# EAGLE design RF-PWR-001 (EAGLE 9.6.2)
DOCNUM: RF-PWR-001; DWBY: Lewis Russell; DWDATE: 3/2/2021; DWINIT: LR; REV: 001; TITLE: RF Power Supply Board

## Sheet 1 of 4
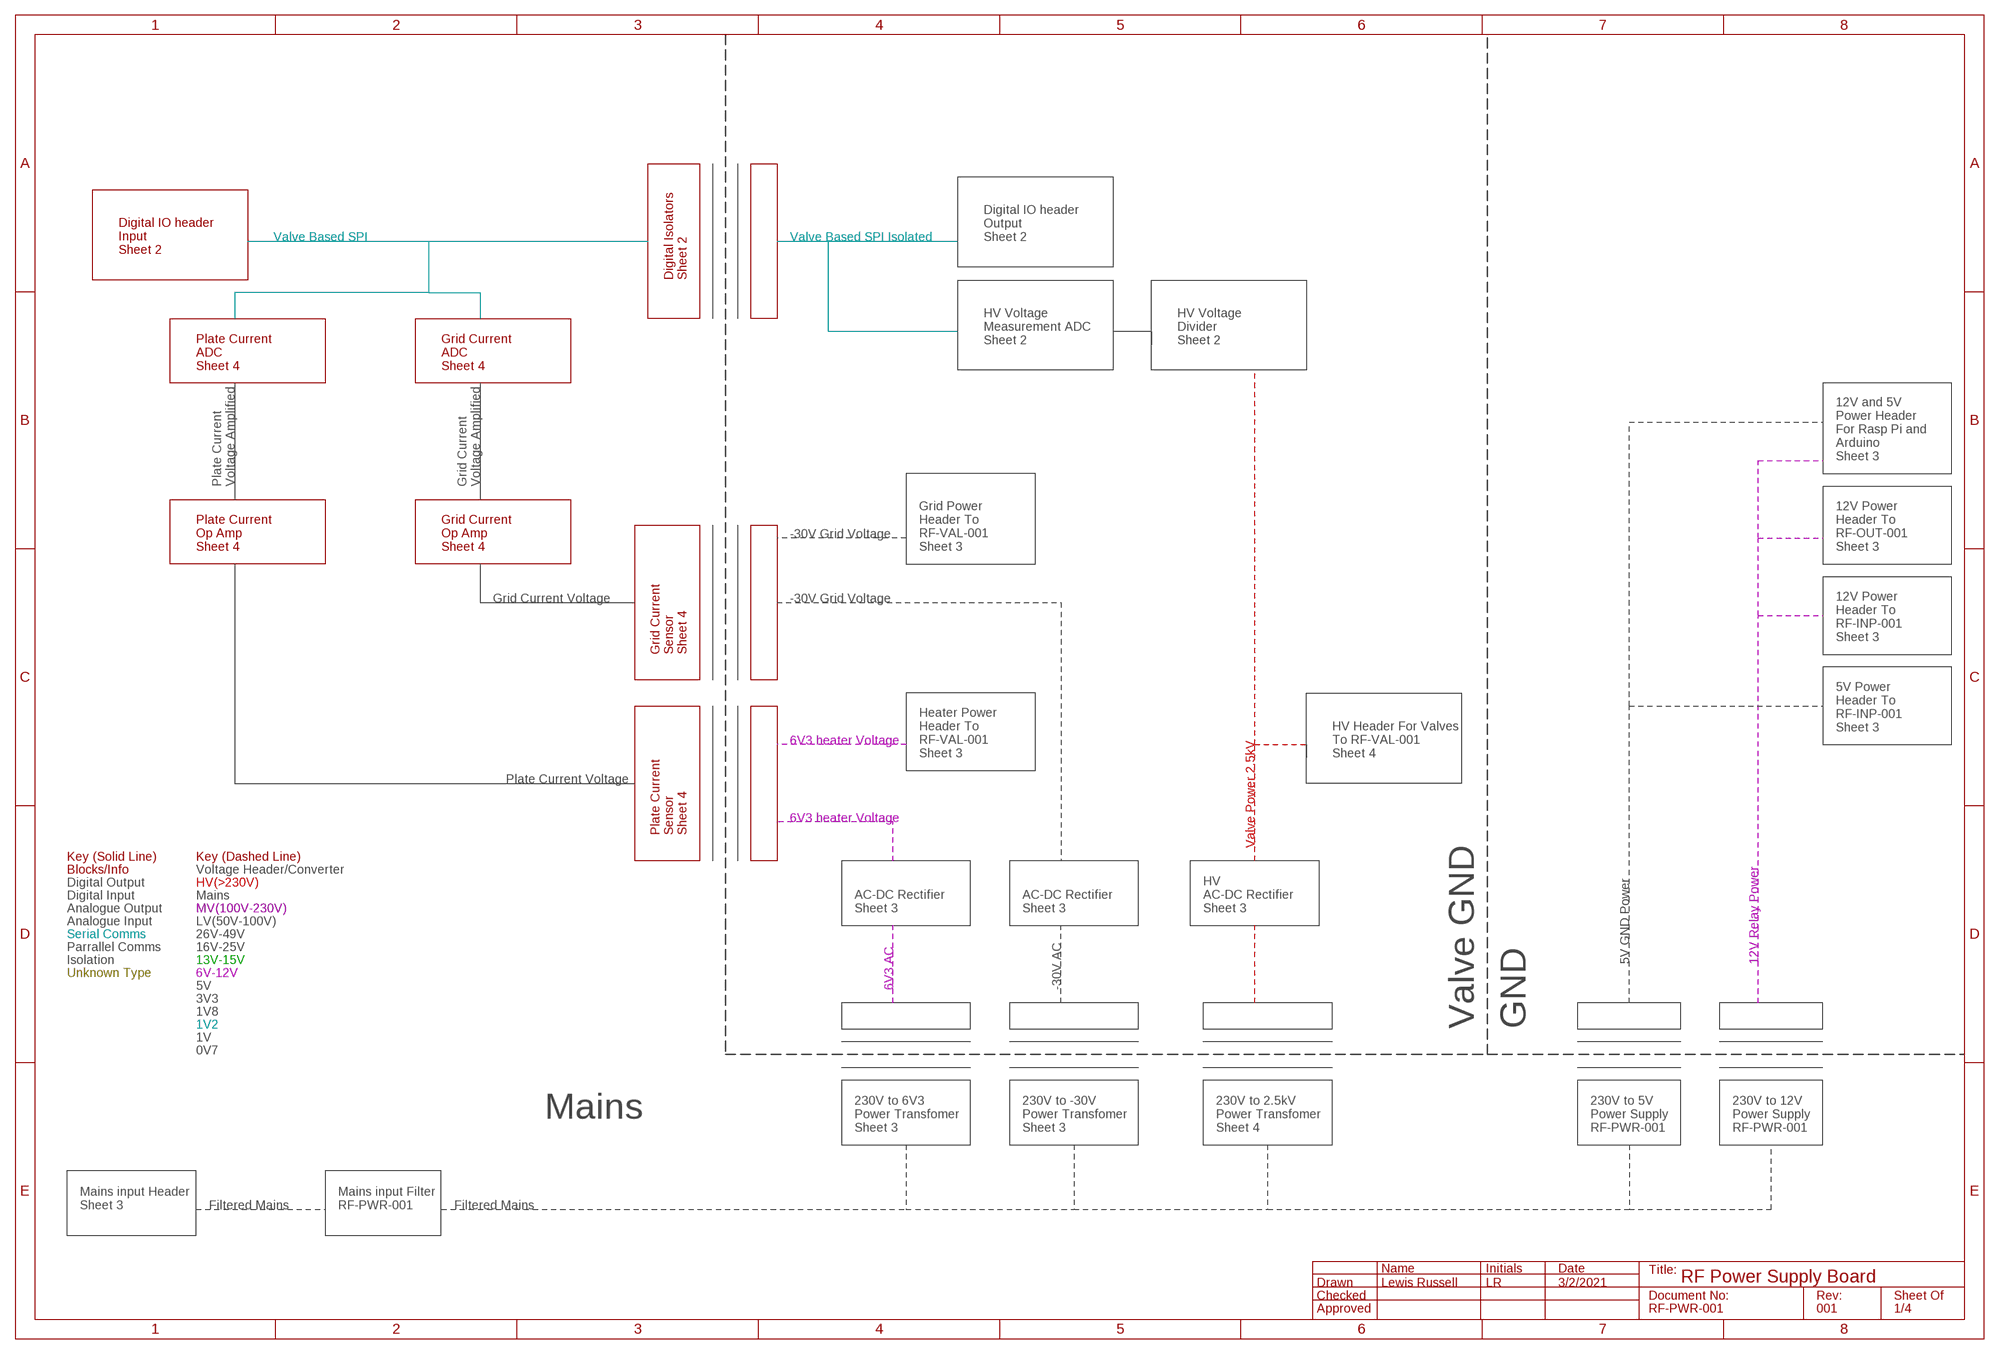
[diagram p0: schematic, sheet 1]

### Notes on the sheet
- Valve Based SPI | Valve Based SPI Isolated
- Digital IO header
  Output
  Sheet 2
- Digital IO header
  Input
  Sheet 2
- Digital Isolators
  Sheet 2
- HV Voltage
  Measurement ADC
  Sheet 2
- HV Voltage
  Divider
  Sheet 2
- Plate Current
  ADC
  Sheet 4
- Grid Current
  ADC
  Sheet 4
- 12V and 5V
  Power Header 
  For Rasp Pi and
  Arduino
  Sheet 3
- Plate Current
  Voltage Amplified
- Grid Current
  Voltage Amplified
- -30V Grid Voltage
- Plate Current
  Op Amp
  Sheet 4
- Grid Current
  Op Amp
  Sheet 4
- Grid Power
  Header To
  RF-VAL-001
  Sheet 3
- 12V Power
  Header To
  RF-OUT-001
  Sheet 3
- Grid Current Voltage | -30V Grid Voltage
- 12V Power
  Header To
  RF-INP-001
  Sheet 3
- Grid Current
  Sensor
  Sheet 4
- 5V Power
  Header To
  RF-INP-001
  Sheet 3
- 6V3 heater Voltage
- Heater Power
  Header To
  RF-VAL-001
  Sheet 3
- HV Header For Valves
  To RF-VAL-001
  Sheet 4
- Plate Current Voltage
- 6V3 heater Voltage
- Plate Current
  Sensor
  Sheet 4
- Valve Power 2.5kV
- Key (Solid Line) | Key (Dashed Line)
- Blocks/Info | Voltage Header/Converter
- Digital Output | HV(>230V)
- Digital Input | Mains
- Analogue Output | MV(100V-230V)
- AC-DC Rectifier
  Sheet 3
- AC-DC Rectifier
  Sheet 3
- HV
  AC-DC Rectifier
  Sheet 3
- Analogue Input | LV(50V-100V)
- Serial Comms | 26V-49V
- Parrallel Comms | 16V-25V
- Isolation | 13V-15V | 5V GND Power | 12V Relay Power
- Unknown Type | 6V-12V
- 5V | 6V3 AC | -30V AC
- 3V3
- 1V8
- 1V2 | Valve GND | GND
- 1V
- 0V7
- Mains
- 230V to 6V3
  Power Transfomer
  Sheet 3
- 230V to -30V
  Power Transfomer
  Sheet 3
- 230V to 2.5kV
  Power Transfomer
  Sheet 4
- 230V to 5V
  Power Supply
  RF-PWR-001
- 230V to 12V
  Power Supply
  RF-PWR-001
- Mains input Header
  Sheet 3
- Filtered Mains
- Mains input Filter
  RF-PWR-001
- Filtered Mains

## Sheet 2 of 4: Isolators
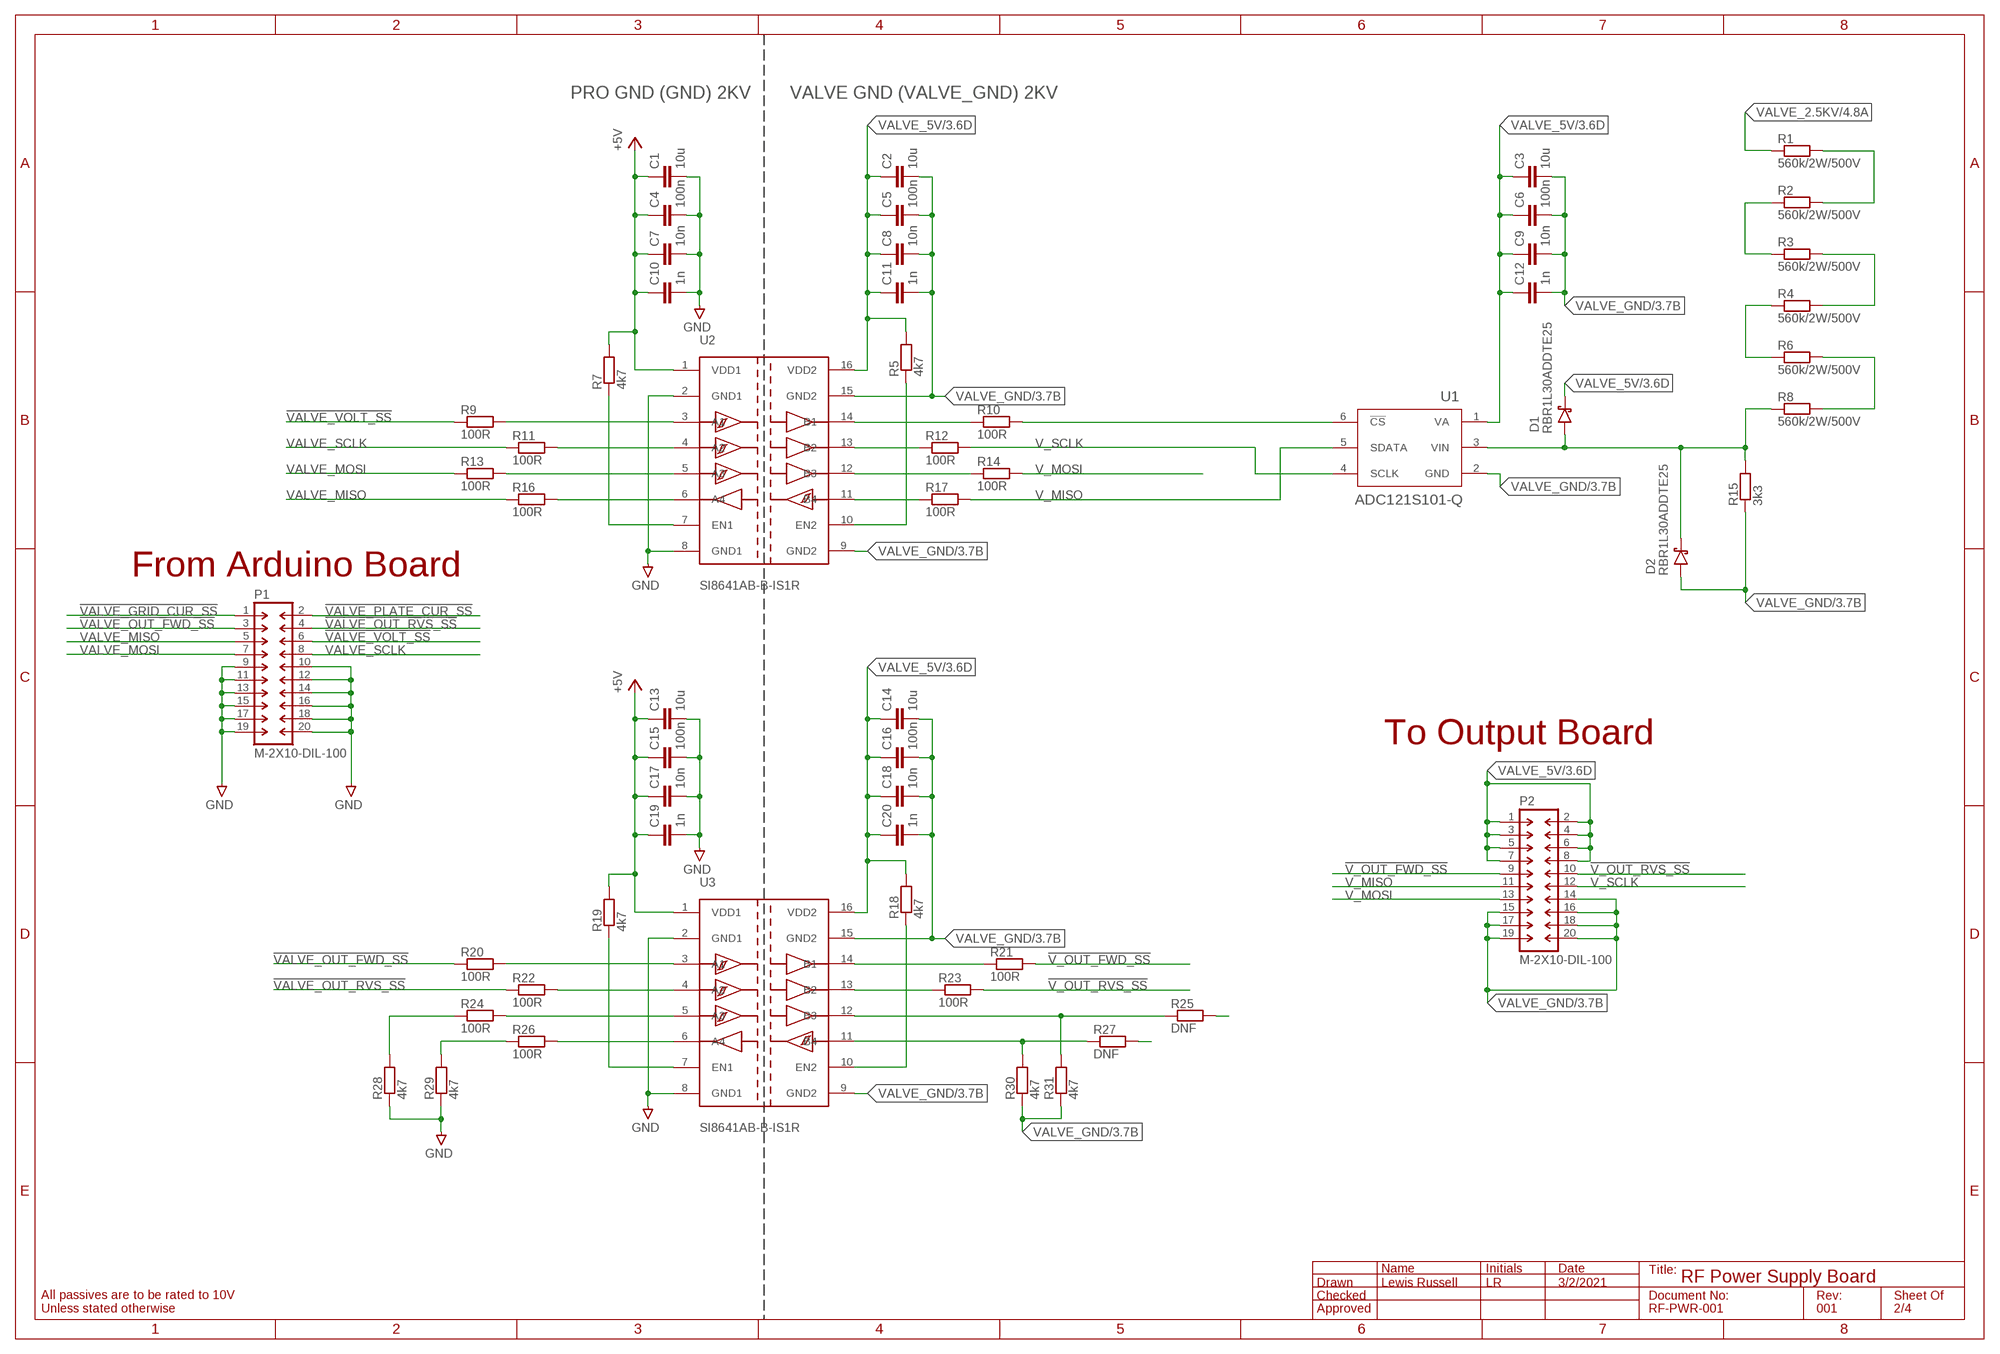
[diagram p1: schematic, sheet 2]

### Parts
C1  10u  C-EUC0805  [C0805]
C2  10u  C-EUC0805  [C0805]
C3  10u  C-EUC0805  [C0805]
C4  100n  C-EUC0603  [C0603]
C5  100n  C-EUC0603  [C0603]
C6  100n  C-EUC0603  [C0603]
C7  10n  C-EUC0603  [C0603]
C8  10n  C-EUC0603  [C0603]
C9  10n  C-EUC0603  [C0603]
C10  1n  C-EUC0603  [C0603]
C11  1n  C-EUC0603  [C0603]
C12  1n  C-EUC0603  [C0603]
C13  10u  C-EUC0805  [C0805]
C14  10u  C-EUC0805  [C0805]
C15  100n  C-EUC0603  [C0603]
C16  100n  C-EUC0603  [C0603]
C17  10n  C-EUC0603  [C0603]
C18  10n  C-EUC0603  [C0603]
C19  1n  C-EUC0603  [C0603]
C20  1n  C-EUC0603  [C0603]
D1  RBR1L30ADDTE25  SCHOTTKY_DIODESMA  [SMA/DO-214AC]
D2  RBR1L30ADDTE25  SCHOTTKY_DIODESMA  [SMA/DO-214AC]
P1  M-2X10-DIL-100  [DIL-100-2X10]
P2  M-2X10-DIL-100  [DIL-100-2X10]
R1  560k/2W/500V  R-EU_SMF2  [SMV1/SMF2]
R2  560k/2W/500V  R-EU_SMF2  [SMV1/SMF2]
R3  560k/2W/500V  R-EU_SMF2  [SMV1/SMF2]
R4  560k/2W/500V  R-EU_SMF2  [SMV1/SMF2]
R5  4k7  R-EUR0603  [R0603]
R6  560k/2W/500V  R-EU_SMF2  [SMV1/SMF2]
R7  4k7  R-EUR0603  [R0603]
R8  560k/2W/500V  R-EU_SMF2  [SMV1/SMF2]
R9  100R  R-EUR0603  [R0603]
R10  100R  R-EUR0603  [R0603]
R11  100R  R-EUR0603  [R0603]
R12  100R  R-EUR0603  [R0603]
R13  100R  R-EUR0603  [R0603]
R14  100R  R-EUR0603  [R0603]
R15  3k3  R-EUR0603  [R0603]
R16  100R  R-EUR0603  [R0603]
R17  100R  R-EUR0603  [R0603]
R18  4k7  R-EUR0603  [R0603]
R19  4k7  R-EUR0603  [R0603]
R20  100R  R-EUR0603  [R0603]
R21  100R  R-EUR0603  [R0603]
R22  100R  R-EUR0603  [R0603]
R23  100R  R-EUR0603  [R0603]
R24  100R  R-EUR0603  [R0603]
R25  DNF  R-EUR0603  [R0603]
R26  100R  R-EUR0603  [R0603]
R27  DNF  R-EUR0603  [R0603]
R28  4k7  R-EUR0603  [R0603]
R29  4k7  R-EUR0603  [R0603]
R30  4k7  R-EUR0603  [R0603]
R31  4k7  R-EUR0603  [R0603]
U1  ADC121S101-Q  [SOT23-6]
U2  SI8641AB-B-IS1R  SI8641SO16  [SO16]
U3  SI8641AB-B-IS1R  SI8641SO16  [SO16]

### Nets
!V_OUT_FWD_SS [Valve LV+Signal]: P2.9 R21.2
!V_OUT_RVS_SS [Valve LV+Signal]: P2.10 R23.2
!VALVE_GRID_CUR_SS [GND Volt+Signal]: P1.1 ; also sheet 4
!VALVE_OUT_FWD_SS [GND Volt+Signal]: P1.3 R20.1
!VALVE_OUT_RVS_SS [GND Volt+Signal]: P1.4 R22.1
!VALVE_PLATE_CUR_SS [GND Volt+Signal]: P1.2 ; also sheet 4
!VALVE_VOLT_SS [GND Volt+Signal]: P1.6 R9.1
+5V [GND Volt+Signal]: C1.1 C4.1 C7.1 C10.1 C13.1 C15.1 C17.1 C19.1 R7.2 R19.2 U2.1(VDD1) U3.1(VDD1) ; also sheet 3,4
GND [GND Volt+Signal]: C1.2 C4.2 C7.2 C10.2 C13.2 C15.2 C17.2 C19.2 P1.9 P1.10 P1.11 P1.12 P1.13 P1.14 P1.15 P1.16 P1.17 P1.18 P1.19 P1.20 R28.1 R29.1 U2.2(GND1) U2.8(GND1) U3.2(GND1) U3.8(GND1) ; also sheet 3,4
N$5 [Valve LV+Signal]: R27.2
N$7 [Valve LV+Signal]: R25.2
N$40 [GND Volt+Signal]: R24.1 R28.2
N$41 [GND Volt+Signal]: R13.2 U2.5(A3)
N$42 [GND Volt+Signal]: R16.2 U2.6(A4)
N$44 [GND Volt+Signal]: R11.2 U2.4(A2)
N$46 [GND Volt+Signal]: R9.2 U2.3(A1)
N$47 [GND Volt+Signal]: R7.1 U2.7(EN1)
N$50 [Valve LV+Signal]: R5.1 U2.10(EN2)
N$51 [Valve LV+Signal]: R14.1 U2.12(B3)
N$54 [Valve LV+Signal]: R17.1 U2.11(B4)
N$55 [Valve LV+Signal]: R27.1 R30.2 U3.11(B4)
N$57 [Valve LV+Signal]: R12.1 U2.13(B2)
N$58 [Valve LV+Signal]: R10.1 U2.14(B1)
N$60 [Valve LV+Signal]: R10.2 U1.6(!CS)
N$61 [Valve LV+Signal]: R23.1 U3.13(B2)
N$62 [Valve LV+Signal]: R21.1 U3.14(B1)
N$63 [Valve LV+Signal]: D1.A(ANODE) D2.C(CATHODE) R8.1 R15.2 U1.3(VIN)
N$68 [Valve Ladder 500V Step]: R4.1 R6.1
N$70 [Valve 500V]: R6.2 R8.2
N$75 [Valve Ladder 500V Step]: R3.2 R4.2
N$77 [Valve Ladder 500V Step]: R1.2 R2.2
N$78 [Valve Ladder 500V Step]: R2.1 R3.1
N$92 [GND Volt+Signal]: R24.2 U3.5(A3)
N$93 [GND Volt+Signal]: R26.2 U3.6(A4)
N$94 [GND Volt+Signal]: R22.2 U3.4(A2)
N$95 [GND Volt+Signal]: R20.2 U3.3(A1)
N$96 [GND Volt+Signal]: R19.1 U3.7(EN1)
N$97 [Valve LV+Signal]: R18.1 U3.10(EN2)
N$98 [Valve LV+Signal]: R25.1 R31.2 U3.12(B3)
N$106 [GND Volt+Signal]: R26.1 R29.2
V_MISO [Valve LV+Signal]: P2.11 R17.2 U1.5(SDATA)
V_MOSI [Valve LV+Signal]: P2.13 R14.2
V_SCLK [Valve LV+Signal]: P2.12 R12.2 U1.4(SCLK)
VALVE_2.5KV [Valve 2500V]: R1.1 ; also sheet 4
VALVE_5V [Valve LV+Signal]: C2.1 C3.1 C5.1 C6.1 C8.1 C9.1 C11.1 C12.1 C14.1 C16.1 C18.1 C20.1 D1.C(CATHODE) P2.1 P2.2 P2.3 P2.4 P2.5 P2.6 P2.7 P2.8 R5.2 R18.2 U1.1(VA) U2.16(VDD2) U3.16(VDD2) ; also sheet 3
VALVE_GND [Valve 48V]: C2.2 C3.2 C5.2 C6.2 C8.2 C9.2 C11.2 C12.2 C14.2 C16.2 C18.2 C20.2 D2.A(ANODE) P2.14 P2.15 P2.16 P2.17 P2.18 P2.19 P2.20 R15.1 R30.1 R31.1 U1.2(GND) U2.9(GND2) U2.15(GND2) U3.9(GND2) U3.15(GND2) ; also sheet 3,4
VALVE_MISO [GND Volt+Signal]: P1.5 R16.1 ; also sheet 4
VALVE_MOSI [GND Volt+Signal]: P1.7 R13.1
VALVE_SCLK [GND Volt+Signal]: P1.8 R11.1 ; also sheet 4

### Notes on the sheet
- PRO GND (GND) 2KV | VALVE GND (VALVE_GND) 2KV
- From Arduino Board
- To Output Board
- All passives are to be rated to 10V
  Unless stated otherwise

## Sheet 3 of 4: Mains Input and Voltage Regulation
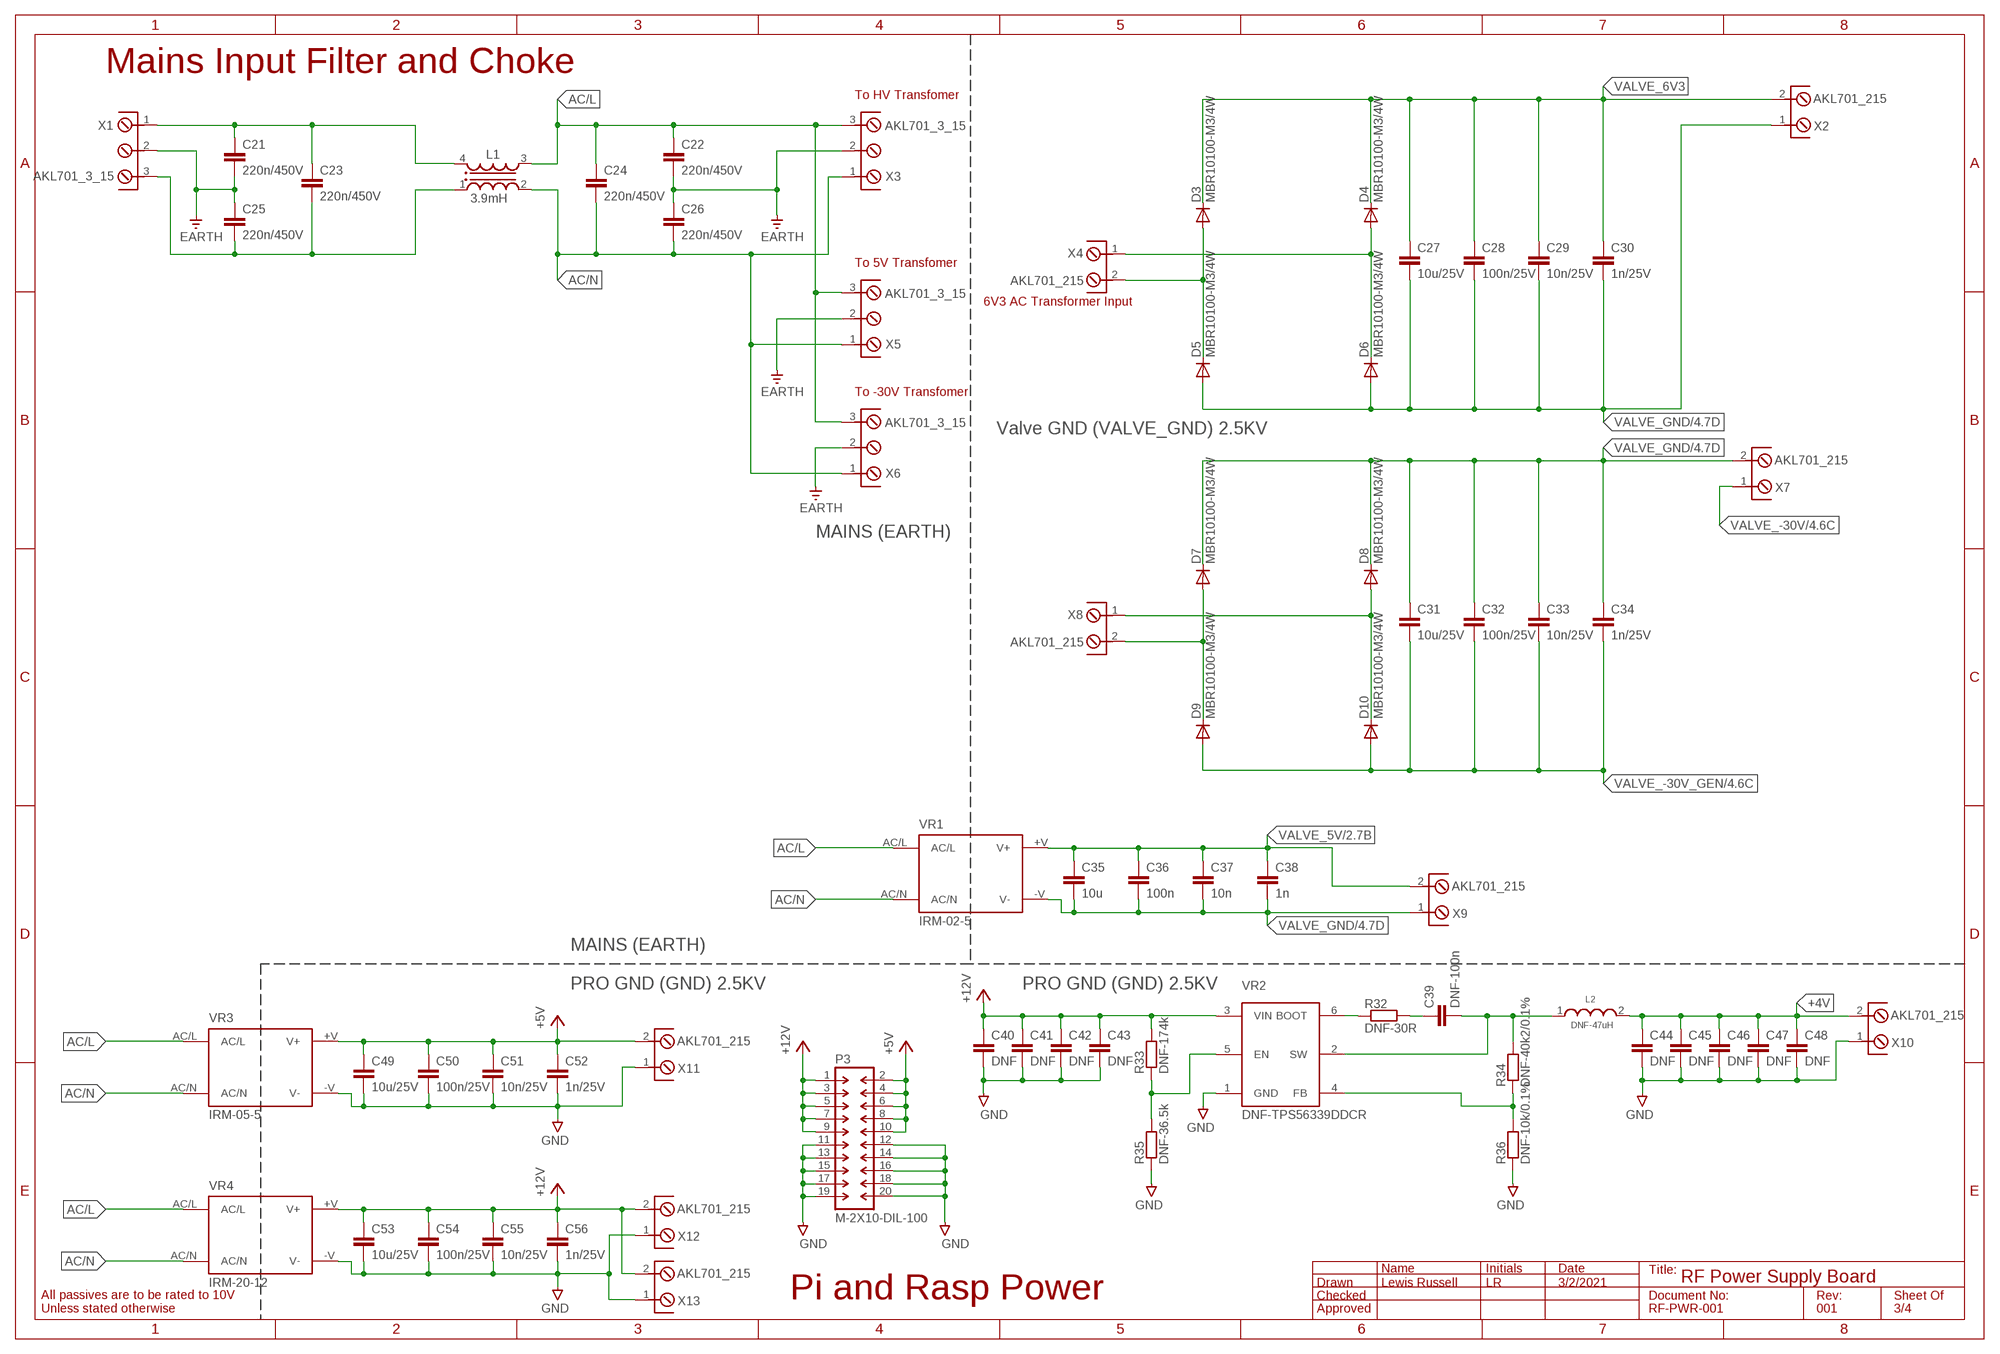
[diagram p2: schematic, sheet 3]

### Parts
C21  220n/450V  C-EUC1210  [C1210]
C22  220n/450V  C-EUC1210  [C1210]
C23  220n/450V  C-EUC1210  [C1210]
C24  220n/450V  C-EUC1210  [C1210]
C25  220n/450V  C-EUC1210  [C1210]
C26  220n/450V  C-EUC1210  [C1210]
C27  10u/25V  C-EUC0805  [C0805]
C28  100n/25V  C-EUC0603  [C0603]
C29  10n/25V  C-EUC0603  [C0603]
C30  1n/25V  C-EUC0603  [C0603]
C31  10u/25V  C-EUC0805  [C0805]
C32  100n/25V  C-EUC0603  [C0603]
C33  10n/25V  C-EUC0603  [C0603]
C34  1n/25V  C-EUC0603  [C0603]
C35  10u  C-EUC0805  [C0805]
C36  100n  C-EUC0603  [C0603]
C37  10n  C-EUC0603  [C0603]
C38  1n  C-EUC0603  [C0603]
C39  DNF-100n  C-EUC0603  [C0603]
C40  DNF  C-EUC0805  [C0805]
C41  DNF  C-EUC0603  [C0603]
C42  DNF  C-EUC0603  [C0603]
C43  DNF  C-EUC0603  [C0603]
C44  DNF  C-EUC1206  [C1206]
C45  DNF  C-EUC0805  [C0805]
C46  DNF  C-EUC0603  [C0603]
C47  DNF  C-EUC0603  [C0603]
C48  DNF  C-EUC0603  [C0603]
C49  10u/25V  C-EUC0805  [C0805]
C50  100n/25V  C-EUC0603  [C0603]
C51  10n/25V  C-EUC0603  [C0603]
C52  1n/25V  C-EUC0603  [C0603]
C53  10u/25V  C-EUC0805  [C0805]
C54  100n/25V  C-EUC0603  [C0603]
C55  10n/25V  C-EUC0603  [C0603]
C56  1n/25V  C-EUC0603  [C0603]
D3  MBR10100-M3/4W  DIODE-TO220V  [TO220ACS]
D4  MBR10100-M3/4W  DIODE-TO220V  [TO220ACS]
D5  MBR10100-M3/4W  DIODE-TO220V  [TO220ACS]
D6  MBR10100-M3/4W  DIODE-TO220V  [TO220ACS]
D7  MBR10100-M3/4W  DIODE-TO220V  [TO220ACS]
D8  MBR10100-M3/4W  DIODE-TO220V  [TO220ACS]
D9  MBR10100-M3/4W  DIODE-TO220V  [TO220ACS]
D10  MBR10100-M3/4W  DIODE-TO220V  [TO220ACS]
L1  3.9mH  WE-FCL_ET35_744866392  [WE-FCL_ET35]
L2  DNF-47uH  WE-HCF_2920_ROUND_74437529203470  [WE-HCF_2920_ROUND]
P3  M-2X10-DIL-100  [DIL-100-2X10]
R32  DNF-30R  R-EUR0603  [R0603]
R33  DNF-174k  R-EUR0603  [R0603]
R34  DNF-40k2/0.1%  R-EUR0603  [R0603]
R35  DNF-36.5k  R-EUR0603  [R0603]
R36  DNF-10k/0.1%  R-EUR0603  [R0603]
VR1  IRM-02-5  [IRM_1-2_TH]
VR2  DNF-TPS56339DDCR  TPS56339DDCR  [SOT23-6]
VR3  IRM-05-5  [IRM_5-10_TH]
VR4  IRM-20-12  [IRM_15-20_TH]
X1  AKL701_3_15  [AKL701_3_15]
X2  AKL701_215  [AKL701_2_15]
X3  AKL701_3_15  [AKL701_3_15]
X4  AKL701_215  [AKL701_2_15]
X5  AKL701_3_15  [AKL701_3_15]
X6  AKL701_3_15  [AKL701_3_15]
X7  AKL701_215  [AKL701_2_15]
X8  AKL701_215  [AKL701_2_15]
X9  AKL701_215  [AKL701_2_15]
X10  AKL701_215  [AKL701_2_15]
X11  AKL701_215  [AKL701_2_15]
X12  AKL701_215  [AKL701_2_15]
X13  AKL701_215  [AKL701_2_15]

### Nets
+4V [GND Volt+Signal]: C44.1 C45.1 C46.1 C47.1 C48.1 L2.2 X10.2
+5V [GND Volt+Signal]: C49.1 C50.1 C51.1 C52.1 P3.2 P3.4 P3.6 P3.8 P3.10 VR3.+V(V+) X11.2 ; also sheet 2,4
+12V [GND Volt+Signal]: C40.1 C41.1 C42.1 C43.1 C53.1 C54.1 C55.1 C56.1 P3.1 P3.3 P3.5 P3.7 P3.9 R33.2 VR2.3(VIN) VR4.+V(V+) X12.2 X13.2
AC/L [Mains]: C22.1 C24.1 L1.3 VR1.AC/L VR3.AC/L VR4.AC/L X3.3 X5.3 X6.3
AC/N [Mains]: C24.2 C26.2 L1.2 VR1.AC/N VR3.AC/N VR4.AC/N X3.1 X5.1 X6.1
EARTH [Mains]: C21.2 C22.2 C25.1 C26.1 X1.2 X3.2 X5.2 X6.2
GND [GND Volt+Signal]: C40.2 C41.2 C42.2 C43.2 C44.2 C45.2 C46.2 C47.2 C48.2 C49.2 C50.2 C51.2 C52.2 C53.2 C54.2 C55.2 C56.2 P3.11 P3.12 P3.13 P3.14 P3.15 P3.16 P3.17 P3.18 P3.19 P3.20 R35.1 R36.1 VR2.1(GND) VR3.-V(V-) VR4.-V(V-) X10.1 X11.1 X12.1 X13.1 ; also sheet 2,4
N$1 [Valve LV+Signal]: D3.A D5.C X4.2
N$2 [Valve LV+Signal]: D4.A D6.C X4.1
N$6 [GND Volt+Signal]: R33.1 R35.2 VR2.5(EN)
N$9 [Valve LV+Signal]: D7.A D9.C X8.2
N$10 [Valve LV+Signal]: D8.A D10.C X8.1
N$31 [Mains]: C21.1 C23.1 L1.4 X1.1
N$35 [Mains]: C23.2 C25.2 L1.1 X1.3
N$104 [GND Volt+Signal]: C39.1 R32.2
N$105 [GND Volt+Signal]: C39.2 L2.1 R34.2 VR2.2(SW)
N$148 [GND Volt+Signal]: R34.1 R36.2 VR2.4(FB)
N$300 [GND Volt+Signal]: R32.1 VR2.6(BOOT)
VALVE_5V [Valve LV+Signal]: C35.1 C36.1 C37.1 C38.1 VR1.+V(V+) X9.2 ; also sheet 2
VALVE_6V3 [Valve LV+Signal]: C27.1 C28.1 C29.1 C30.1 D3.C D4.C X2.2
VALVE_-30V [Valve 48V]: X7.1 ; also sheet 4
VALVE_-30V_GEN [Valve 48V]: C31.2 C32.2 C33.2 C34.2 D9.A D10.A ; also sheet 4
VALVE_GND [Valve 48V]: C27.2 C28.2 C29.2 C30.2 C31.1 C32.1 C33.1 C34.1 C35.2 C36.2 C37.2 C38.2 D5.A D6.A D7.C D8.C VR1.-V(V-) X2.1 X7.2 X9.1 ; also sheet 2,4

### Notes on the sheet
- Mains Input Filter and Choke
- To HV Transfomer
- To 5V Transfomer
- 6V3 AC Transformer Input
- To -30V Transfomer
- Valve GND (VALVE_GND) 2.5KV
- MAINS (EARTH)
- MAINS (EARTH)
- PRO GND (GND) 2.5KV | PRO GND (GND) 2.5KV
- Pi and Rasp Power
- All passives are to be rated to 10V
  Unless stated otherwise

## Sheet 4 of 4: HV Rectification and Current Sensing
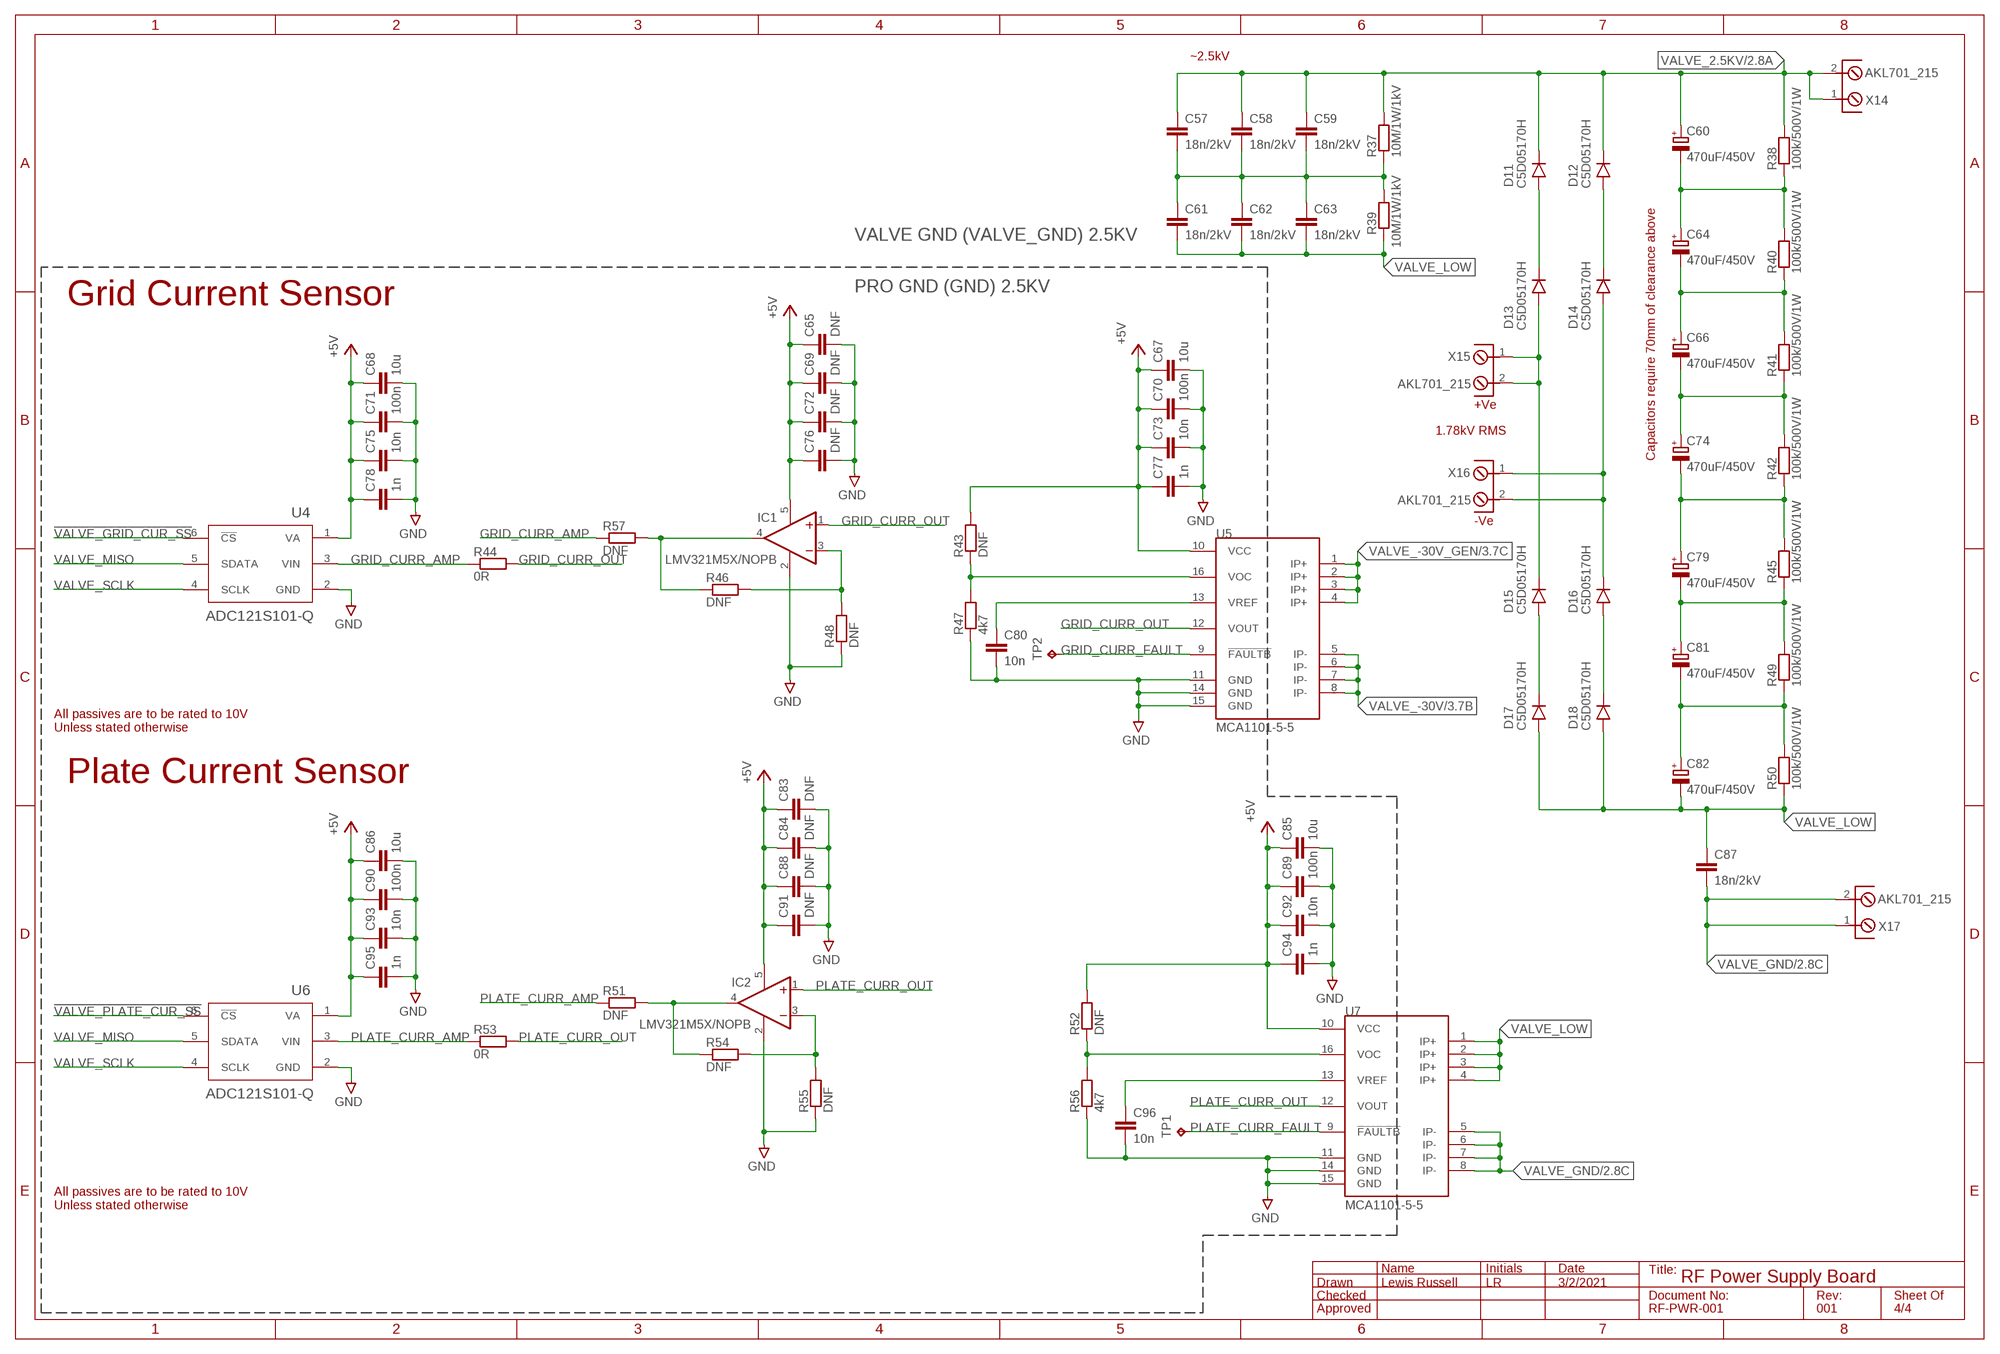
[diagram p3: schematic, sheet 4]

### Parts
C57  18n/2kV  C-EU050-075X075  [C050-075X075]
C58  18n/2kV  C-EU050-075X075  [C050-075X075]
C59  18n/2kV  C-EU050-075X075  [C050-075X075]
C60  470uF/450V  ALC10D-35MM  [STYLE_D(35MM)]
C61  18n/2kV  C-EU050-075X075  [C050-075X075]
C62  18n/2kV  C-EU050-075X075  [C050-075X075]
C63  18n/2kV  C-EU050-075X075  [C050-075X075]
C64  470uF/450V  ALC10D-35MM  [STYLE_D(35MM)]
C65  DNF  C-EUC0805  [C0805]
C66  470uF/450V  ALC10D-35MM  [STYLE_D(35MM)]
C67  10u  C-EUC0805  [C0805]
C68  10u  C-EUC0805  [C0805]
C69  DNF  C-EUC0603  [C0603]
C70  100n  C-EUC0603  [C0603]
C71  100n  C-EUC0603  [C0603]
C72  DNF  C-EUC0603  [C0603]
C73  10n  C-EUC0603  [C0603]
C74  470uF/450V  ALC10D-35MM  [STYLE_D(35MM)]
C75  10n  C-EUC0603  [C0603]
C76  DNF  C-EUC0603  [C0603]
C77  1n  C-EUC0603  [C0603]
C78  1n  C-EUC0603  [C0603]
C79  470uF/450V  ALC10D-35MM  [STYLE_D(35MM)]
C80  10n  C-EUC0603  [C0603]
C81  470uF/450V  ALC10D-35MM  [STYLE_D(35MM)]
C82  470uF/450V  ALC10D-35MM  [STYLE_D(35MM)]
C83  DNF  C-EUC0805  [C0805]
C84  DNF  C-EUC0603  [C0603]
C85  10u  C-EUC0805  [C0805]
C86  10u  C-EUC0805  [C0805]
C87  18n/2kV  C-EU050-075X075  [C050-075X075]
C88  DNF  C-EUC0603  [C0603]
C89  100n  C-EUC0603  [C0603]
C90  100n  C-EUC0603  [C0603]
C91  DNF  C-EUC0603  [C0603]
C92  10n  C-EUC0603  [C0603]
C93  10n  C-EUC0603  [C0603]
C94  1n  C-EUC0603  [C0603]
C95  1n  C-EUC0603  [C0603]
C96  10n  C-EUC0603  [C0603]
D11  C5D05170H  DIODEC1A3-2  [TO-247-2]
D12  C5D05170H  DIODEC1A3-2  [TO-247-2]
D13  C5D05170H  DIODEC1A3-2  [TO-247-2]
D14  C5D05170H  DIODEC1A3-2  [TO-247-2]
D15  C5D05170H  DIODEC1A3-2  [TO-247-2]
D16  C5D05170H  DIODEC1A3-2  [TO-247-2]
D17  C5D05170H  DIODEC1A3-2  [TO-247-2]
D18  C5D05170H  DIODEC1A3-2  [TO-247-2]
IC1  LMV321M5X/NOPB  LMV321M5  [SOT23-5]
IC2  LMV321M5X/NOPB  LMV321M5  [SOT23-5]
R37  10M/1W/1kV  R-EUR2512  [R2512]
R38  100k/500V/1W  R-EUR2512  [R2512]
R39  10M/1W/1kV  R-EUR2512  [R2512]
R40  100k/500V/1W  R-EUR2512  [R2512]
R41  100k/500V/1W  R-EUR2512  [R2512]
R42  100k/500V/1W  R-EUR2512  [R2512]
R43  DNF  R-EUR0603  [R0603]
R44  0R  R-EUR0603  [R0603]
R45  100k/500V/1W  R-EUR2512  [R2512]
R46  DNF  R-EUR0603  [R0603]
R47  4k7  R-EUR0603  [R0603]
R48  DNF  R-EUR0603  [R0603]
R49  100k/500V/1W  R-EUR2512  [R2512]
R50  100k/500V/1W  R-EUR2512  [R2512]
R51  DNF  R-EUR0603  [R0603]
R52  DNF  R-EUR0603  [R0603]
R53  0R  R-EUR0603  [R0603]
R54  DNF  R-EUR0603  [R0603]
R55  DNF  R-EUR0603  [R0603]
R56  4k7  R-EUR0603  [R0603]
R57  DNF  R-EUR0603  [R0603]
TP1  TPTP16R  [TP16R]
TP2  TPTP16R  [TP16R]
U4  ADC121S101-Q  [SOT23-6]
U5  MCA1101-5-5  [SOIC_16]
U6  ADC121S101-Q  [SOT23-6]
U7  MCA1101-5-5  [SOIC_16]
X14  AKL701_215  [AKL701_2_15]
X15  AKL701_215  [AKL701_2_15]
X16  AKL701_215  [AKL701_2_15]
X17  AKL701_215  [AKL701_2_15]

### Nets
!VALVE_GRID_CUR_SS [GND Volt+Signal]: U4.6(!CS) ; also sheet 2
!VALVE_PLATE_CUR_SS [GND Volt+Signal]: U6.6(!CS) ; also sheet 2
+5V [GND Volt+Signal]: C65.1 C67.1 C68.1 C69.1 C70.1 C71.1 C72.1 C73.1 C75.1 C76.1 C77.1 C78.1 C83.1 C84.1 C85.1 C86.1 C88.1 C89.1 C90.1 C91.1 C92.1 C93.1 C94.1 C95.1 IC1.5(V+) IC2.5(V+) R43.2 R52.2 U4.1(VA) U5.10(VCC) U6.1(VA) U7.10(VCC) ; also sheet 2,3
GND [GND Volt+Signal]: C65.2 C67.2 C68.2 C69.2 C70.2 C71.2 C72.2 C73.2 C75.2 C76.2 C77.2 C78.2 C80.2 C83.2 C84.2 C85.2 C86.2 C88.2 C89.2 C90.2 C91.2 C92.2 C93.2 C94.2 C95.2 C96.2 IC1.2(V-) IC2.2(V-) R47.1 R48.1 R55.1 R56.1 U4.2(GND) U5.11(GND) U5.14(GND) U5.15(GND) U6.2(GND) U7.11(GND) U7.14(GND) U7.15(GND) ; also sheet 2,3
GRID_CURR_AMP [GND Volt+Signal]: R44.1 R57.1 U4.3(VIN)
GRID_CURR_FAULT [GND Volt+Signal]: TP2.TP U5.9(!FAULTB)
GRID_CURR_OUT [GND Volt+Signal]: IC1.1(+IN) R44.2 U5.12(VOUT)
N$3 [GND Volt+Signal]: IC1.4(OUT) R46.1 R57.2
N$8 [GND Volt+Signal]: IC2.4(OUT) R51.2 R54.1
N$36 [Valve 500V]: C81.-VE(-) C82.+VE(+) R49.1 R50.2
N$56 [Valve 2500V]: D11.3(ANODE) D13.1(CATHODE)
N$59 [Valve 2500V]: D15.3(ANODE) D17.1(CATHODE)
N$65 [Valve 2500V]: D12.3(ANODE) D14.1(CATHODE)
N$66 [Valve 2500V]: D16.3(ANODE) D18.1(CATHODE)
N$69 [Valve Ladder 500V Step]: C79.-VE(-) C81.+VE(+) R45.1 R49.2
N$71 [Valve Ladder 500V Step]: C66.-VE(-) C74.+VE(+) R41.1 R42.2
N$72 [Valve Ladder 500V Step]: C64.-VE(-) C66.+VE(+) R40.1 R41.2
N$73 [Valve Ladder 500V Step]: C60.-VE(-) C64.+VE(+) R38.1 R40.2
N$74 [Valve Ladder 500V Step]: C74.-VE(-) C79.+VE(+) R42.1 R45.2
N$76 [GND Volt+Signal]: R52.1 R56.2 U7.16(VOC)
N$79 [GND Volt+Signal]: C96.1 U7.13(VREF)
N$99 [Valve 1250V]: C57.2 C58.2 C59.2 C61.1 C62.1 C63.1 R37.1 R39.2
N$149 [GND Volt+Signal]: R43.1 R47.2 U5.16(VOC)
N$154 [GND Volt+Signal]: IC2.3(-IN) R54.2 R55.2
N$155 [GND Volt+Signal]: C80.1 U5.13(VREF)
N$156 [GND Volt+Signal]: IC1.3(-IN) R46.2 R48.2
PLATE_CURR_AMP [GND Volt+Signal]: R51.1 R53.1 U6.3(VIN)
PLATE_CURR_FAULT [GND Volt+Signal]: TP1.TP U7.9(!FAULTB)
PLATE_CURR_OUT [GND Volt+Signal]: IC2.1(+IN) R53.2 U7.12(VOUT)
VALVE_2.5KV [Valve 2500V]: C57.1 C58.1 C59.1 C60.+VE(+) D11.1(CATHODE) D12.1(CATHODE) R37.2 R38.2 X14.1 X14.2 ; also sheet 2
VALVE_-30V [Valve 48V]: U5.5(IP-) U5.6(IP-) U5.7(IP-) U5.8(IP-) ; also sheet 3
VALVE_-30V_GEN [Valve 48V]: U5.1(IP+) U5.2(IP+) U5.3(IP+) U5.4(IP+) ; also sheet 3
VALVE_GND [Valve 48V]: C87.2 U7.5(IP-) U7.6(IP-) U7.7(IP-) U7.8(IP-) X17.1 X17.2 ; also sheet 2,3
VALVE_LOW [Valve LV+Signal]: C61.2 C62.2 C63.2 C82.-VE(-) C87.1 D17.3(ANODE) D18.3(ANODE) R39.1 R50.1 U7.1(IP+) U7.2(IP+) U7.3(IP+) U7.4(IP+)
VALVE_MISO [GND Volt+Signal]: U4.5(SDATA) U6.5(SDATA) ; also sheet 2
VALVE_PWR_+VE [Valve 2500V]: D13.3(ANODE) D15.1(CATHODE) X15.1 X15.2
VALVE_PWR_-VE [Valve 2500V]: D14.3(ANODE) D16.1(CATHODE) X16.1 X16.2
VALVE_SCLK [GND Volt+Signal]: U4.4(SCLK) U6.4(SCLK) ; also sheet 2

### Notes on the sheet
- ~2.5kV
- VALVE GND (VALVE_GND) 2.5KV
- PRO GND (GND) 2.5KV
- Grid Current Sensor
- +Ve
- 1.78kV RMS
- Capacitors require 70mm of clearance above
- -Ve
- All passives are to be rated to 10V
  Unless stated otherwise
- Plate Current Sensor
- All passives are to be rated to 10V
  Unless stated otherwise

## Library data of the parts
C1-C59 C61-C63 C65 C67-C73 C75-C78 C80 C83-C96 = Mage-Control:C-EU: CAPACITOR, European symbol
C60 C64 C66 C74 C79 C81 C82 = ALC10:ALC10D: ALC10 Aluminum Electrolytic Capacitors Using Termination Style D Up to 600VDC ratings High Ripple Current 47uF-100mF Operational Lifespan in hours D (mm), Rated Voltage and Ripple @ 85C/Rated Voltage @ 85C 25, 10000/16000 30, 13000/21000 35, 15000/24000 40, 18000/29000 45, 18000/29000 50, 18000/29000 Made By: Lewis Russell 13/8/2020 Checked By: Jamie SLavin 19/08/2020
D1 D2 = DO-214 Diodes:SCHOTTKY_DIODE: DO-214 package regular diode Varients SMA = DO-214AC SMB = DO-214AA SMC = DO-214AB Made By: Lewis Russell 29/6/2020 Checked By: Fraser Douglas 29/6/2020
D3-D10 = _mod_diode:DIODE-: DIODE
D11-D18 = TO-247 Diode:DIODE: TO-247 package regular diode TO-247-2 Package Varients C1A3-2 = Cathode on Pin 1, Annode on Pin 3 C3A1-2 = Cathode on Pin 3, Annode on Pin 1 TO-247-3 Package Varients C12A3-3 = Cathode on Pin 1 and 2, Annode on Pin 3 C13A2-3 = Cathode on Pin 1 and 3, Annode on Pin 2 C23A1-3 = Cathode on Pin 2 and 3, Annode on Pin 1 C1A23-3 = Cathode on Pin 1, Annode on Pin 2 and 3 C2A13-3 = Cathode on Pin 2, Annode on Pin 1 and 3 C3A12-3 = Cathode on Pin 3, Annode on Pin 1 and 2 Some parts will have an electrically conductive thermal pad Made By: Lewis Russell 29/6/2020 Checked By: Fraser Douglas 12/08/2020 Checked By: Jamie Slavin 18/08/2020 (Series Components)
IC1 IC2 = linear:LMV321?*: General Purpose, Low Voltage, Rail-to-Rail Output Operational Amplifiers Source: http://www.national.com/mpf/LM/LMV321.html http://www.national.com/dt/lmv_qual.pdf
L1 = Wurth_EMC Components_WE-FCL:WE-FCL_ET35: WE-FCL Common Mode Power Line Choke Characteristics Approximate 1% stray inductance for symmetrical interference suppression Closed rectangular ferrite core Attenuation up to 75 dB with high rated current. Inductance Tolerance: +50 %/-30% Flammability corresponding to UL 94 V-0 Climatic category 40/125/21 Application Mains filter Suppression of common mode noise Switched mode power supplies Electronic ballast applications Lighting White goods <https://katalog.we-online.com/media/images/v2/o14784v209%20Family_WE-FCL_ET35.jpg> Details see: https://katalog.we-online.com/en/pbs/WE-FCL Updated by Ella Wu 2019-05-31 2019 (C) Wurth Elektronik; DATASHEET-URL: https://katalog.we-online.com/pbs/datasheet/744866392.pdf; IR: 5A; MOUNT: THT; PART-NUMBER: 744866392; RDC: 50mOhm; VR: 250 V (AC); VT: 1500 V (AC)
L2 = Wurth_Power Magnetics_WE-HCF:WE-HCF_2920_ROUND: WE-HCF SMD High Current Inductor Characteristics Saturation current up to 125 A Flat, round and litz wire version to optimize the DC & AC losses Inductance values ranging from 0.7 µH to 680 µH Low core losses (MnZn) Magnetically shielded Litz and round wire: base for SMD mount and coplanarity Operating temperature: -40°C to +125°C Applications Storage inductor for high efficiency DC/DC converters with high ripple currents CRM, CCM & DCM PFC Stages Resonant SMPS Filter for audio applications <https://www.we-online.com/catalog/media/o107965v209%20Family_WE-HCF_2018_2.jpg> Details see: https://www.we-online.com/catalog/en/WE-HCF Updated by Yingchun Shan 2019-08-07 2019 (C) Wurth Elektronik; DATASHEET-URL: https://www.we-online.com/catalog/datasheet/74437529203470.pdf; FRES: 6.7MHz; IR: 18.7A; ISAT: 13A; PART-NUMBER: 74437529203470; RDC: 8.8mOhm; VALUE: 47uH
P1-P3 = con-headers-jp:M-2X10-: MALE HEADER
R1-R4 R6 R8 = TE Connectivity SM_ Resistors:R-EU: TE Connectivity SM_ Series Resistors SMV = Thick Film Resistors 1-3W SMF = Thin Film Resistors 2,3,5W SMW = Wirewound Resistors 2,3,5W Tollerances SMV = 5% SMF/SMW = 1% or 5% Temperture Range = -55 to 200C E24 Working Voltages SMV1 = 1600 VDC, 1150 VRMS SMV2 = 3500 VDC, 2500 VRMS SMV3 = 5000 VDC, 3500 VRMS SMW/F2 = 300V SMW/F3 = 500V SMW/F5 = 500V Made By: Lewis Russell 13/8/2020 Checked By: Jamie Slavin Date: 17/08/2020
R5 R7 R9-R57 = Mage-Control:R-EU: RESISTOR, European symbol
TP1 TP2 = testpad:TP: Test pad
U1 U4 U6 = ADC121S101:ADC121S101-Q: Single-Channel, 0.5 to 1-Msps, 12-Bit Analog-to-Digital Converter 2.7-5.5V supply range, -40C to +125C temperature range. Automotive qualified. Made by: Francis Pettitt Date: 11/05/20 Checked by: Jamie Slavin Date: 11/05/20
U2 U3 = SI8641:SI8641: SI8641 4 channel digital islator High Speed Operation up to 150Mbps Operating votlage = 2.5-5.5V -40C to 125C 3 Forward/1Backwards Automotive qualitifcation https://www.mouser.co.uk/datasheet/2/368/si864x-datasheet-1154572.pdf Created by: Francis Pettitt 15/01/20 Reviewed by: Lewis Russell 24/8/2020
U5 U7 = MCA1101-CC-V:MCA1101: MCA1101-CC-V Bidierectional Isolating Current sensor IC CC = Current Rating = 05, 20 and 50 V = Voltage Rating = 3V3 or 5V Availiable in 5, 20 and 50A Variants 0.6% Error @ 25C 2% max error over temperture range Operating Temp = -40 to 105C Isolation Dielectic strength Voltage = 4800V Basic Isolation Voltage = 1097 VRMS Reinforced Isolation Voltage = 400 VRMS Package = SOIC-16 Frequency Response = 1.5MHz (typical 3dB BW) Made by: Lewis Russell 9/4/2020 Checked by:
VR1 = IRM AC to DC:IRM-02: IRM 2W AC to DC Converter Several output voltages from 3.3V to 24V no load power consumption = 0.075W Isolation Resistance = 100MOhm 500VDC Up to 77% efficency Made By: Lewis Russell 5/8/2020 Checked by: Fraser Douglas 5/8/2020
VR2 = TPS56339:TPS56339DDCR: TPS56339 Synchronous Buck Converter Input Voltage= 4.5V to 24V Output Voltage = 0.8V to 16V 3A Maximum Continuous Output Current 500 KHz Switching Frequency Package SOT-23-6 Made By: Lewis Russell 5/8/2020 Checked By: Fraser Douglas 6/8/2020
VR3 = IRM AC to DC:IRM-05: IRM 5W AC to DC Converter Several output voltages from 3.3V to 24V no load power consumption = 0.1W Isolation Resistance = 100MOhm 500VDC Up to 77% efficency Made By: Lewis Russell 5/8/2020 Checked by: Fraser Douglas 5/8/2020
VR4 = IRM AC to DC:IRM-20: IRM 20W AC to DC Converter Several output voltages from 3.3V to 24V no load power consumption = 0.1W Isolation Resistance = 100MOhm 500VDC Up to 85% efficency Made By: Lewis Russell 5/8/2020 Checked by: Fraser Douglas 5/8/2020
X1 X3 X5 X6 = _con_riacon_akl701:AKL701_3*: RIACON (Ria Connect) Screw Type Terminal Block Type AKL 701 - 3 (pole-size: 3) centerline 6.35 mm / 0.250 inches, 400 V / 24 A, horizontal wire entry, lift system, modular packages: _13: recommended pcb hole dia. = 1,3 mm _15: pcb hole dia. = 1,5 mm (prototyping) Auhtor: Dipl.-Ing. FH Rainer Bayer, Hochschule Heilbronn (rainer.bayer@hs-heilbronn.de)
X2 X4 X7-X17 = _con_riacon_akl701:AKL701_2*: RIACON (Ria Connect) Screw Type Terminal Block Type AKL 701 - 2 (pole-size: 2) centerline 6.35 mm / 0.250 inches, 400 V / 24 A, horizontal wire entry, lift system, modular packages: _13: recommended pcb hole dia. = 1,3 mm _15: pcb hole dia. = 1,5 mm (prototyping) Auhtor: Dipl.-Ing. FH Rainer Bayer, Hochschule Heilbronn (rainer.bayer@hs-heilbronn.de)

## Net classes
1 Mains: width 0.7 mm, drill 0.4 mm, clearance 1 mm to class 0, clearance 0.8 mm
2 GND Volt+Signal: width 0.2 mm, drill 0.4 mm, clearance 10 mm to class 0, clearance 6.9 mm to class 1, clearance 0.13 mm
3 Valve LV+Signal: width 0.2 mm, drill 0.4 mm, clearance 10 mm to class 0, clearance 6.9 mm to class 1, clearance 3.2 mm to class 2, clearance 0.13 mm
4 Valve 48V: width 0.2 mm, drill 0.4 mm, clearance 10 mm to class 0, clearance 6.9 mm to class 1, clearance 3.2 mm to class 2, clearance 0.13 mm to class 3, clearance 0.13 mm
5 Valve 500V: width 0.2 mm, drill 0.4 mm, clearance 10 mm to class 0, clearance 14.525 mm to class 1, clearance 14.525 mm to class 2, clearance 0.8 mm to class 3, clearance 0.8 mm to class 4, clearance 0.8 mm
6 HV_SIG: width 0.2 mm, drill 0.4 mm, clearance 10 mm to class 0, clearance 3.2 mm to class 1, clearance 3.2 mm to class 2, clearance 14.525 mm to class 3, clearance 0.13 mm to class 4, clearance 3.2 mm to class 5, clearance 0.13 mm
8 Valve 1250V: width 0.2 mm, drill 0.4 mm, clearance 10 mm to class 0, clearance 14.525 mm to class 1, clearance 14.525 mm to class 2, clearance 3.087 mm to class 3, clearance 3.087 mm to class 4, clearance 1.562 mm to class 5, clearance 0.8 mm to class 6, clearance 0.8 mm to class 7, clearance 3.087 mm
9 Valve 2500V: width 0.2 mm, drill 0.4 mm, clearance 10 mm to class 0, clearance 14.525 mm to class 1, clearance 14.525 mm to class 2, clearance 6.9 mm to class 3, clearance 6.9 mm to class 4, clearance 6.9 mm to class 5, clearance 6.9 mm to class 6, clearance 6.9 mm to class 7, clearance 3.087 mm to class 8, clearance 6.9 mm
10 Valve Ladder 500V Step: width 0.2 mm, drill 0.4 mm, clearance 10 mm to class 0, clearance 14.525 mm to class 1, clearance 14.525 mm to class 2, clearance 6.9 mm to class 3, clearance 6.9 mm to class 4, clearance 0.8 mm to class 5, clearance 6.9 mm to class 6, clearance 6.9 mm to class 7, clearance 6.9 mm to class 8, clearance 0.8 mm to class 9, clearance 0.8 mm

## Board
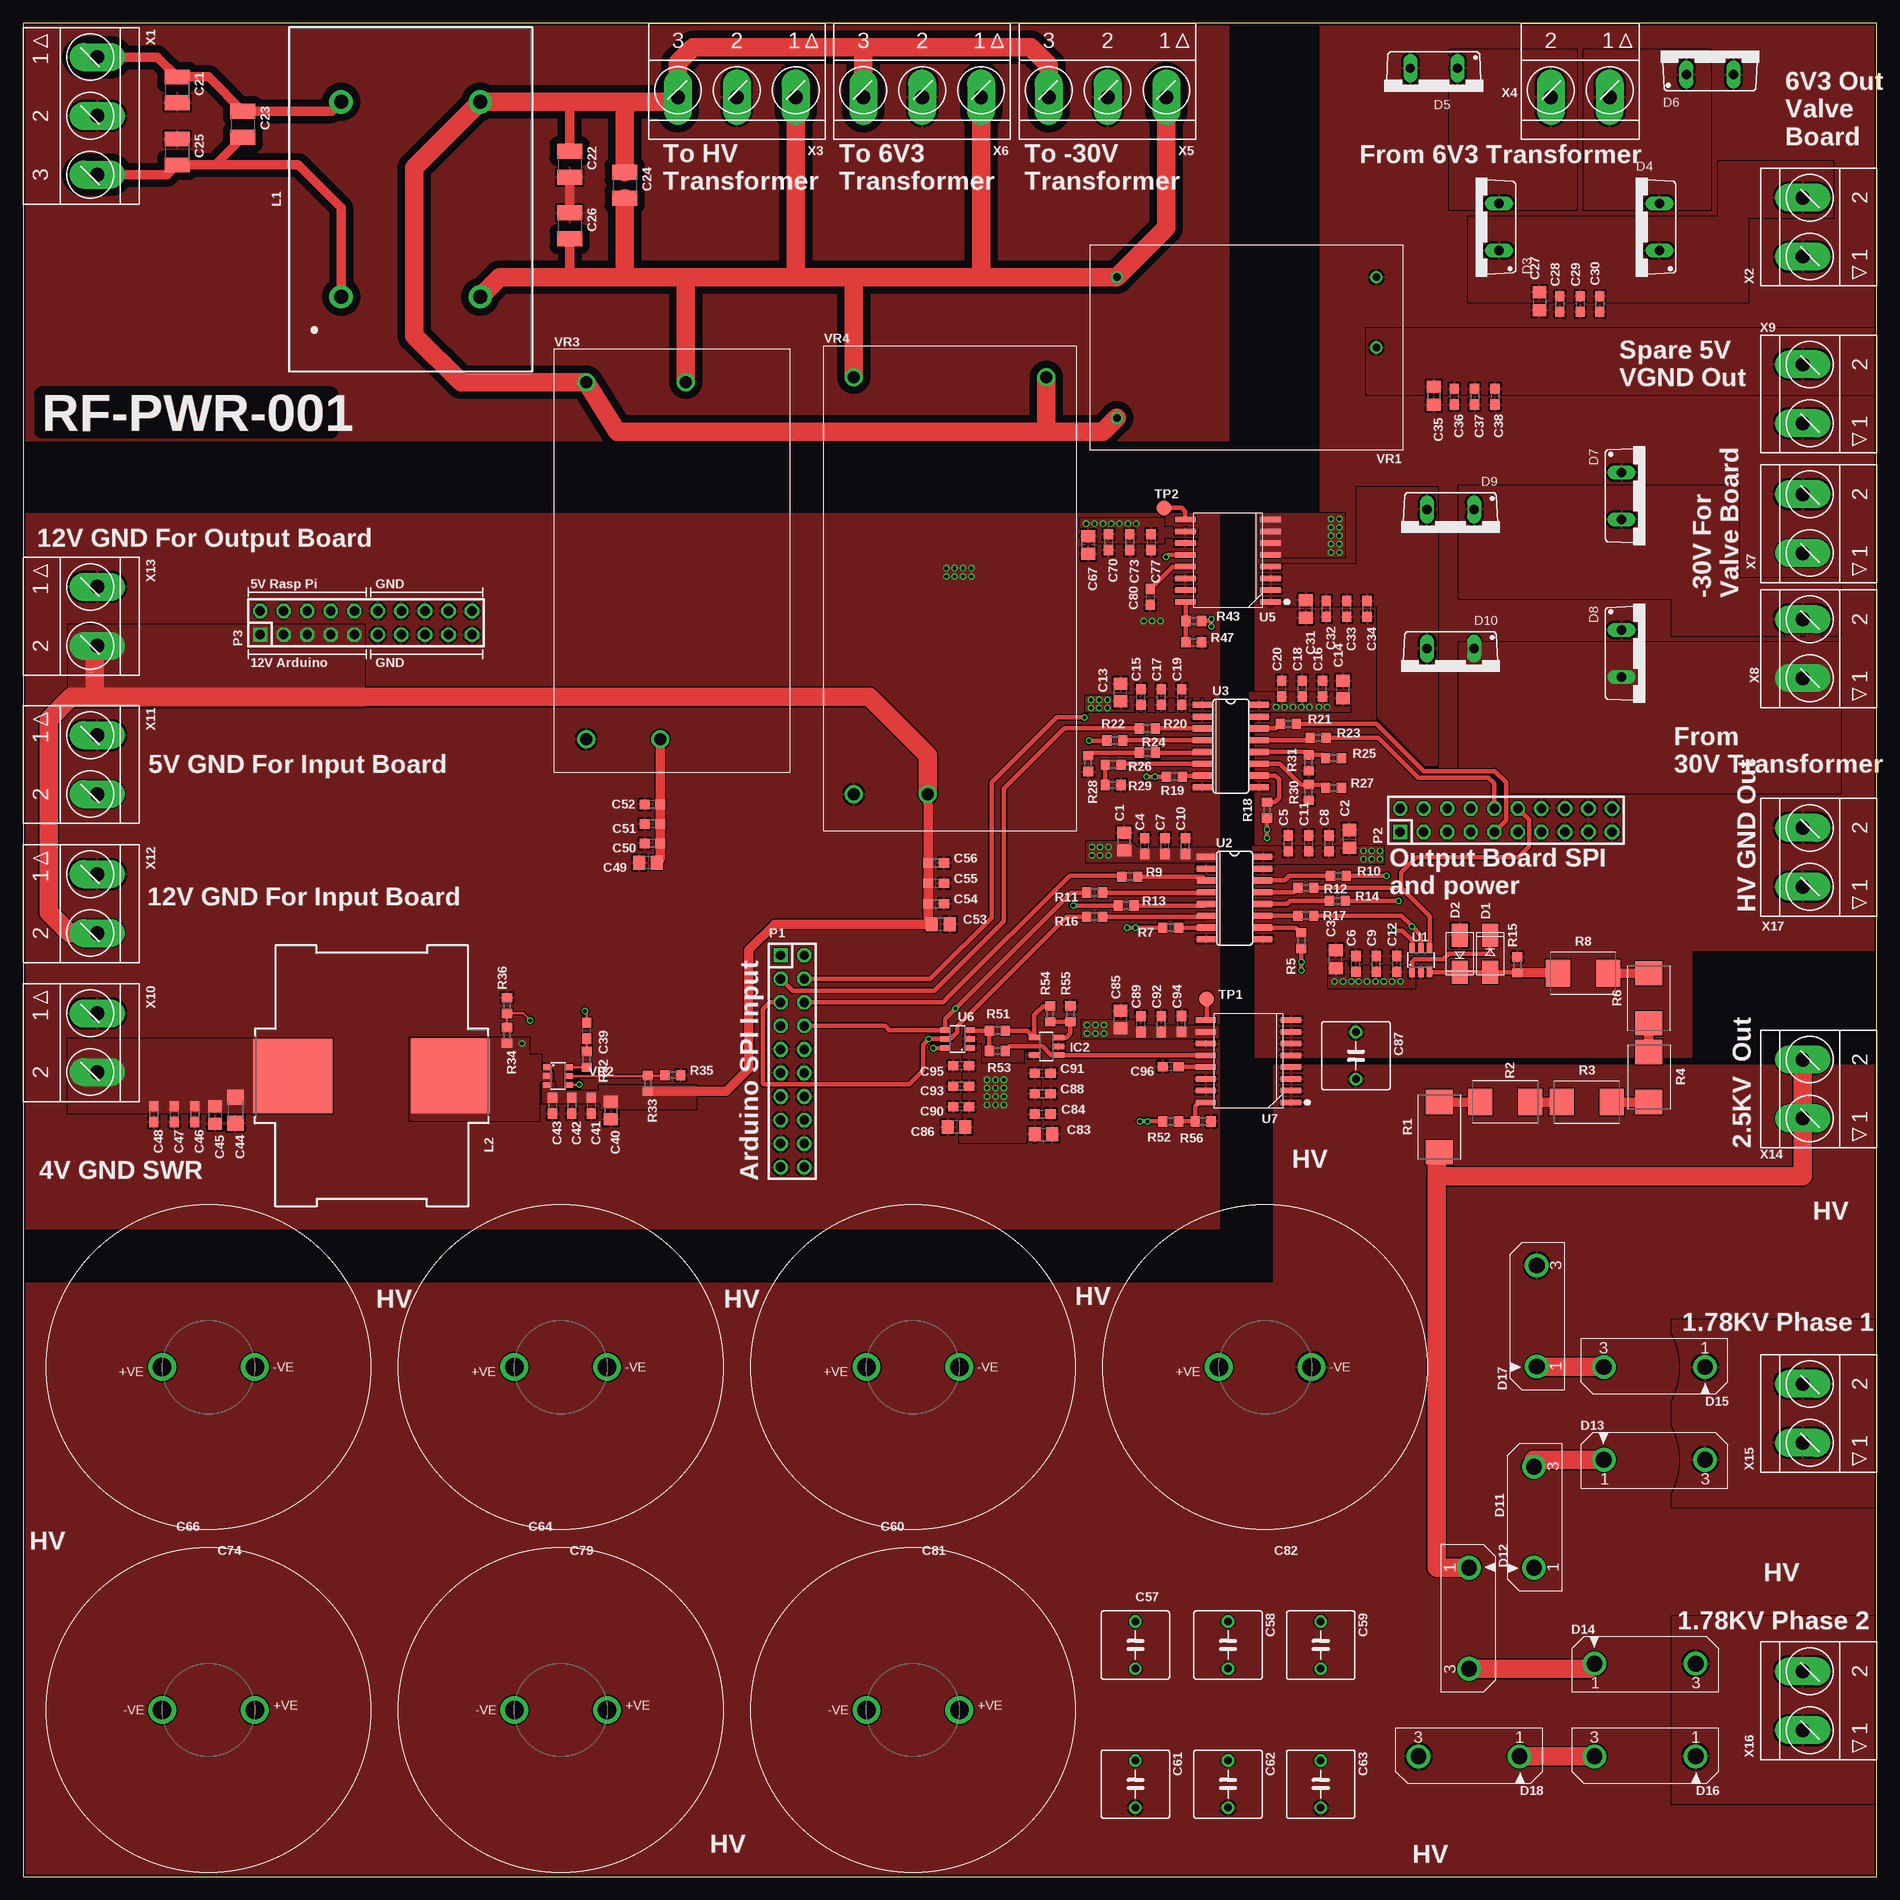
[diagram p4: board, top side]
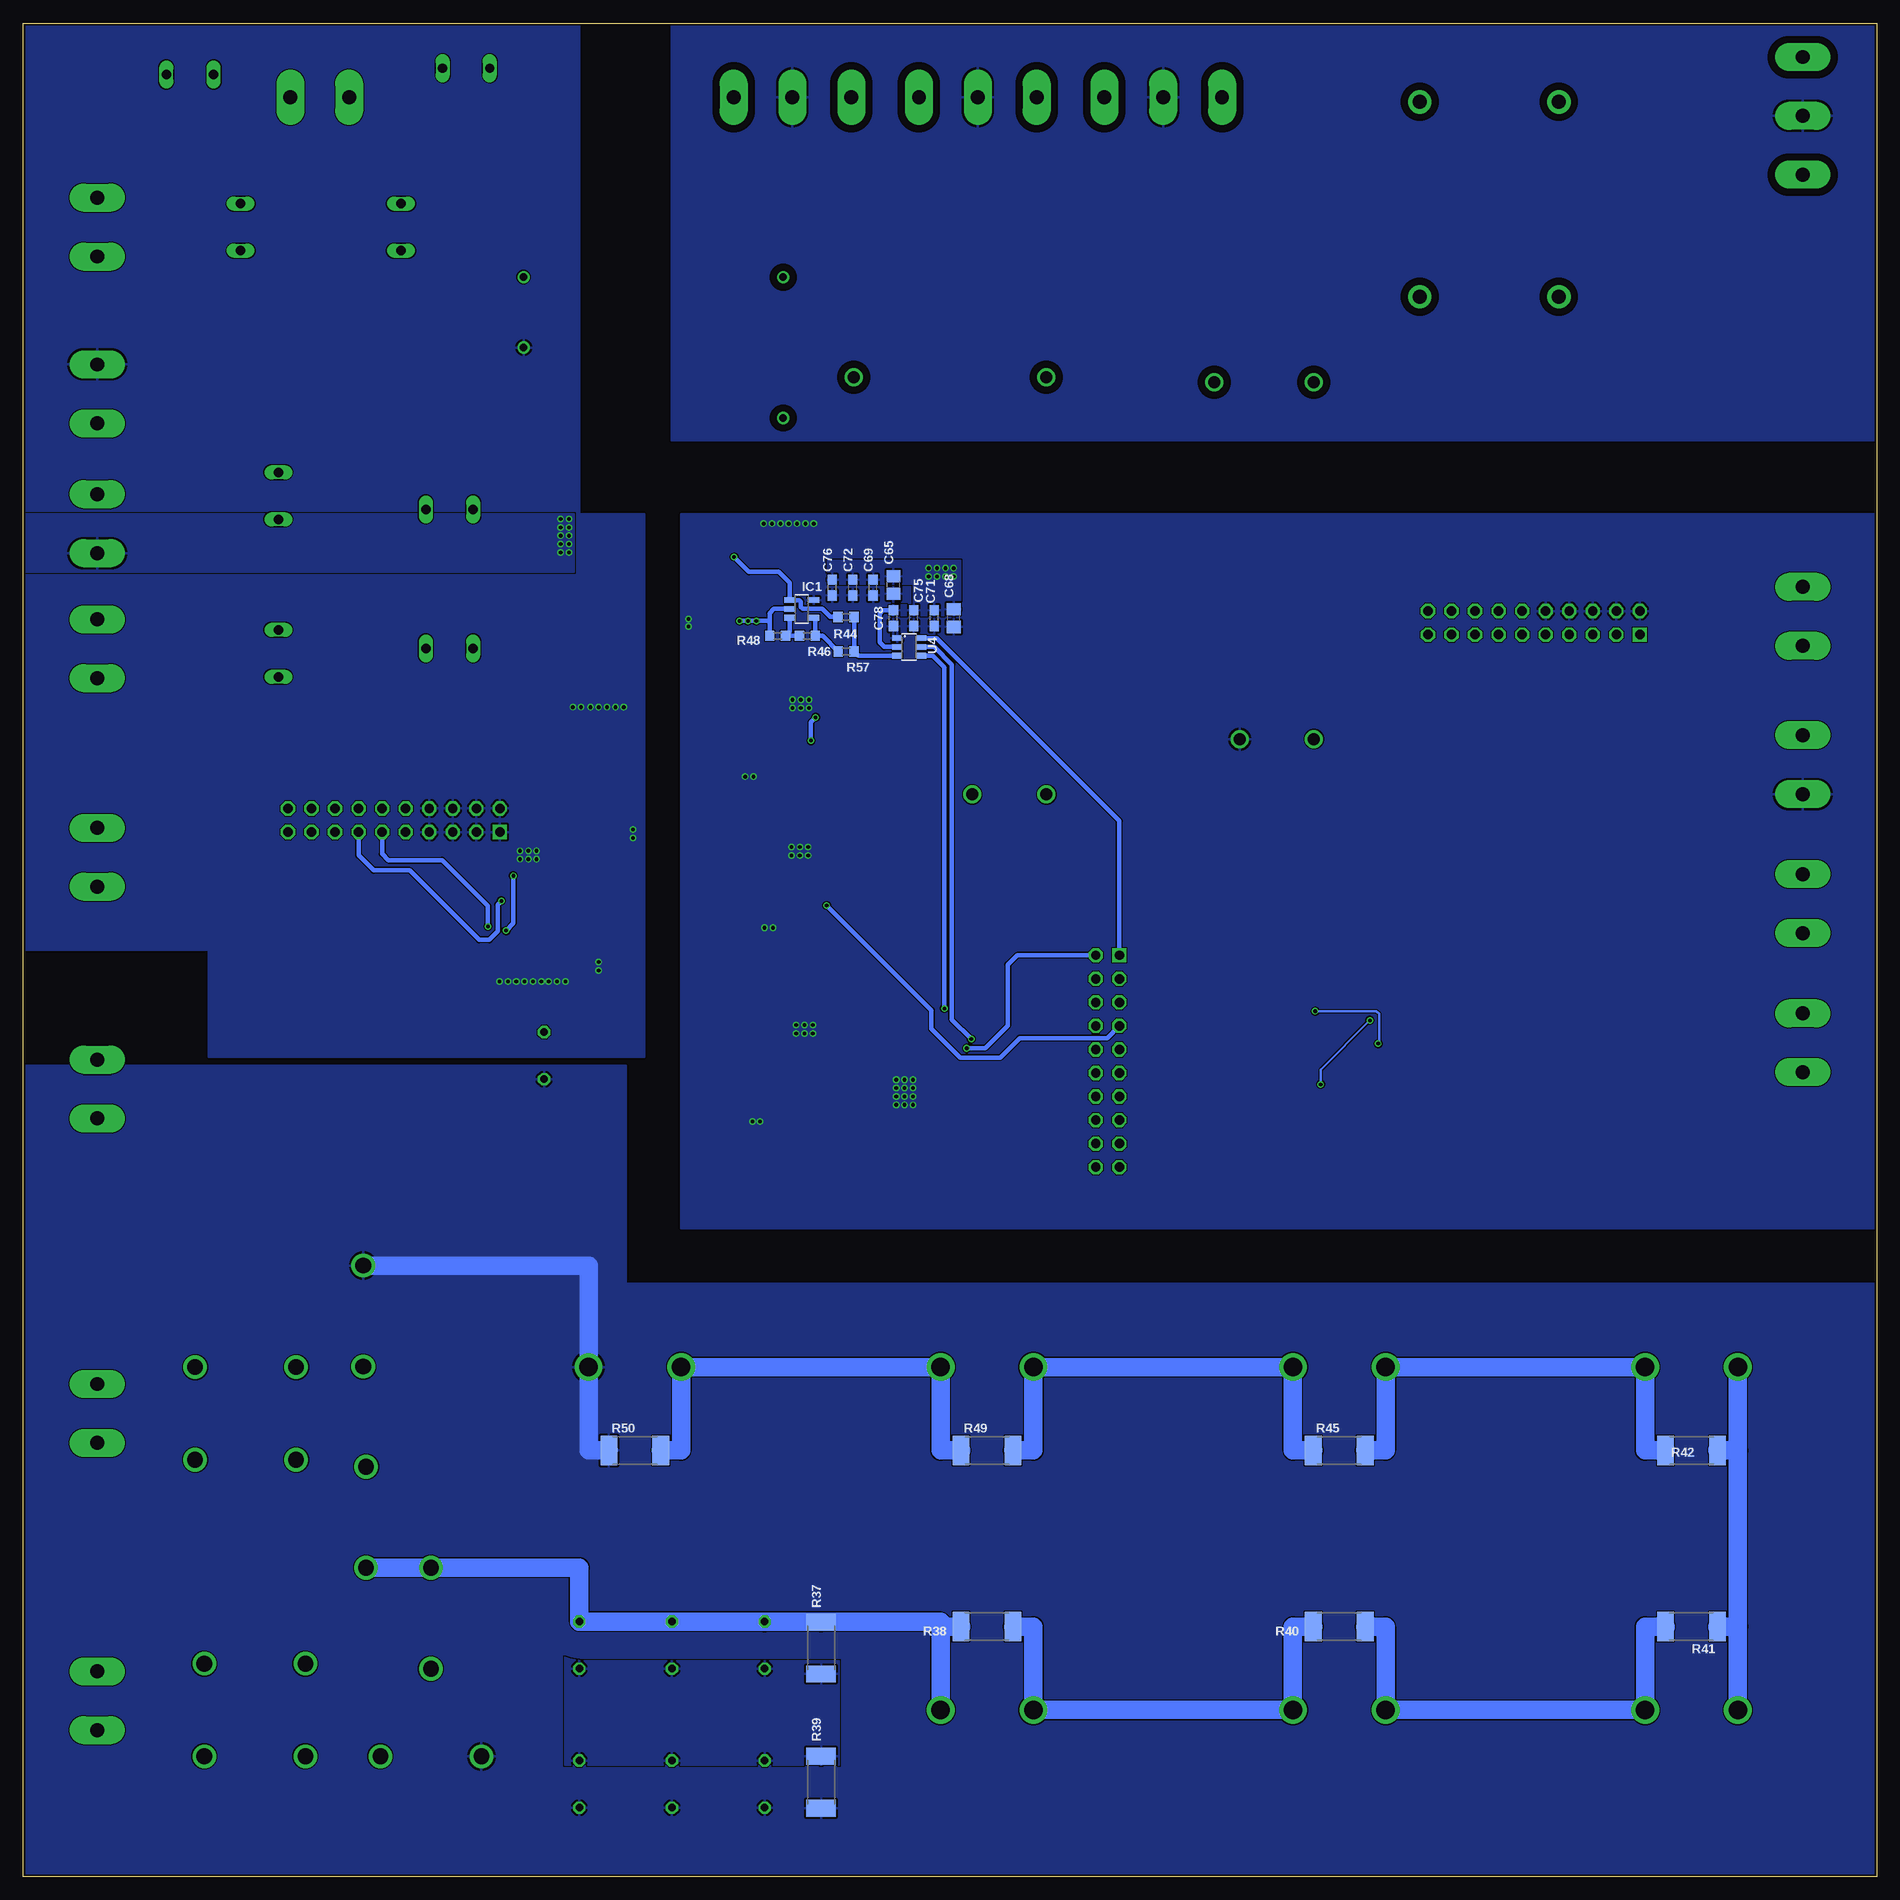
[diagram p5: board, bottom side, seen from below]

Size 200 x 200 mm. Coordinates in mm from the lower left corner, seen from the top.
Outline: 0,0 200,0 200,200 0,200 0,0
Copper layers (1*16): Top 0.035mm / dielectric 1.5mm / Bottom 0.035mm
Design rules "dirtyPCBdru": minimum track width 5mil, minimum drill 12mil, track to track 5mil, track to pad 5mil, pad to pad 5mil, via to via 5mil, smd to smd 0mil, copper to edge 10mil, drill to drill 10mil, minimum pad ring 10mil, minimum via ring 6mil, stop-mask expansion 2mil, vias tented up to drill 25mil, thermal gap 10mil

### Footprints (pad centres in the part's own frame; a part is rotated, then mirrored left to right if it is on the bottom)
C0805 = smd 1.3 x 1.5: 1 -0.95,0; 2 0.95,0
C0603 = smd 1.1 x 1: 1 -0.85,0; 2 0.85,0
C1210 = smd 1.6 x 2.7: 1 -1.4,0; 2 1.4,0
C1206 = smd 1.6 x 1.8: 1 -1.4,0; 2 1.4,0
C050-075X075 = drill 0.813 octagon: 1 -2.54,0; 2 2.54,0
STYLE_D(35MM) = drill 2: +VE 5,0; -VE -5,0
SMA/DO-214AC = smd 2.5 x 1.7: A 2,0; C -2,0
TO220ACS = drill 1.016 long: A 2.54,-2.54; C -2.54,-2.54
TO-247-2 = drill 1.7: 1 -5.45,0; 3 5.45,0
SOT23-5 = smd 0.6 x 1.2: 1 -0.95,-1.306; 2 0,-1.306; 3 0.95,-1.306; 4 0.95,1.306; 5 -0.95,1.306
WE-FCL_ET35 = drill 1.5 pad 2.5: 1 -10.5,7.5; 2 -10.5,-7.5; 3 10.5,-7.5; 4 10.5,7.5
WE-HCF_2920_ROUND = smd 8 x 8.5: 1 0,8.5; 2 0,-8.5
DIL-100-2X10 = drill 1.016 square: 1 -11.43,-1.27 | drill 1.016 octagon: 2 -11.43,1.27; 3 -8.89,-1.27; 4 -8.89,1.27; 5 -6.35,-1.27; 6 -6.35,1.27; 7 -3.81,-1.27; 8 -3.81,1.27; 9 -1.27,-1.27; 10 -1.27,1.27; 11 1.27,-1.27; 12 1.27,1.27; 13 3.81,-1.27; 14 3.81,1.27; 15 6.35,-1.27; 16 6.35,1.27; 17 8.89,-1.27; 18 8.89,1.27; 19 11.43,-1.27; 20 11.43,1.27
SMV1/SMF2 = smd 2.6 x 2.9: 1 -2.7,0; 2 2.7,0
R0603 = smd 1 x 1.1: 1 -0.85,0; 2 0.85,0
R2512 = smd 1.8 x 3.2: 1 -2.8,0; 2 2.8,0
TP16R = smd 1.6 x 1.6: TP 0,0
SOT23-6 = smd 0.6 x 1.1: 1 -0.95,-1.3; 2 0,-1.3; 3 0.95,-1.3; 4 0.95,1.3; 5 0,1.3; 6 -0.95,1.3
SO16 = smd 0.66 x 2.032: 1 -4.445,-3.073; 2 -3.175,-3.073; 3 -1.905,-3.073; 4 -0.635,-3.073; 5 0.635,-3.073; 6 1.905,-3.073; 7 3.175,-3.073; 8 4.445,-3.073; 9 4.445,3.073; 10 3.175,3.073; 11 1.905,3.073; 12 0.635,3.073; 13 -0.635,3.073; 14 -1.905,3.073; 15 -3.175,3.073; 16 -4.445,3.073
SOIC_16 = smd 2.2 x 0.6: 1 -4.6,4.445; 2 -4.6,3.175; 3 -4.6,1.905; 4 -4.6,0.635; 5 -4.6,-0.635; 6 -4.6,-1.905; 7 -4.6,-3.175; 8 -4.6,-4.445; 9 4.6,-4.445; 10 4.6,-3.175; 11 4.6,-1.905; 12 4.6,-0.635; 13 4.6,0.635; 14 4.6,1.905; 15 4.6,3.175; 16 4.6,4.445
IRM_1-2_TH = drill 0.8: +V -14,0; -V -14,-7.6; AC/L 14,7.6; AC/N 14,-7.6
SOT23-6' = smd 0.6 x 0.9: 1 -0.95,-1.15; 2 0,-1.15; 3 0.95,-1.15; 4 0.95,1.15; 5 0,1.15; 6 -0.95,1.15
IRM_5-10_TH = drill 1.3: +V 19.25,-1.25; -V 19.25,-9.25; AC/L -19.25,-9.25; AC/N -19.25,1.5
IRM_15-20_TH = drill 1.3: +V 22.2,-2.4; -V 22.2,-10.4; AC/L -22.8,10.4; AC/N -22.8,-10.4
AKL701_3_15 = drill 1.5 pad 3 long: 1 -6.35,0; 2 0,0; 3 6.35,0
AKL701_2_15 = drill 1.5 pad 3 long: 1 -3.175,0; 2 3.175,0

### Placement (x,y rotation side)
C1  118.8,111.7 90 top
C2  143.1,112 90 top
C3  141.6,99 90 top
C4  121,111.2 90 top
C5  136.5,111.5 90 top
C6  143.8,98.5 90 top
C7  123.2,111.2 90 top
C8  140.9,111.5 90 top
C9  146,98.5 90 top
C10  125.4,111.2 90 top
C11  138.7,111.5 90 top
C12  148.2,98.5 90 top
C13  118.4,127.8 90 top
C14  142.4,128.1 90 top
C15  120.6,127.3 90 top
C16  140.2,128.2 90 top
C17  122.8,127.3 90 top
C18  138,128.2 90 top
C19  125,127.3 90 top
C20  135.8,128.2 90 top
C21  16.6,192.8 270 top
C22  58.96,184.79 270 top
C23  23.7,189.1 270 top
C24  64.9,182.5 270 top
C25  16.6,186.1 270 top
C26  58.96,178.13 270 top
C27  163.6,170 270 top
C28  165.8,169.7 270 top
C29  168,169.7 270 top
C30  170.1,169.7 270 top
C31  138.4,136.8 90 top
C32  140.6,136.8 90 top
C33  142.8,136.8 90 top
C34  145,136.8 90 top
C35  152.2,159.8 270 top
C36  154.4,159.7 270 top
C37  156.6,159.7 270 top
C38  158.8,159.7 270 top
C39  60.8,91.3 90 top
C40  63.4,82.7 270 top
C41  61.3,83.2 270 top
C42  59.2,83.2 270 top
C43  57.1,83.2 270 top
C44  22.9,82.7 270 top
C45  20.7,82.2 270 top
C46  18.5,82.3 270 top
C47  16.3,82.3 270 top
C48  14.1,82.3 270 top
C49  67.4,109.4 180 top
C50  67.9,111.5 180 top
C51  67.9,113.6 180 top
C52  67.9,115.7 180 top
C53  99,102.8 0 top
C54  98.5,105 0 top
C55  98.5,107.2 0 top
C56  98.5,109.4 0 top
C57  120,25 270 top
C58  130,25 270 top
C59  140,25 270 top
C60  96,18 0 top
C61  120,10 270 top
C62  130,10 270 top
C63  140,10 270 top
C64  58,18 0 top
C65  106.1,139.4 90 bottom
C66  20,18 0 top
C67  114.9,143.7 270 top
C68  99.6,135.8 90 bottom
C69  108.3,139.1 90 bottom
C70  117.1,144 270 top
C71  101.7,135.8 90 bottom
C72  110.5,139.1 90 bottom
C73  119.4,144 270 top
C74  20,55 180 top
C75  103.9,135.8 90 bottom
C76  112.7,139.1 90 bottom
C77  121.7,144 270 top
C78  106.1,135.8 90 bottom
C79  58,55 180 top
C80  121.6,138.1 270 top
C81  96,55 180 top
C82  134,55 180 top
C83  110.1,80.1 0 top
C84  110,82.3 0 top
C85  118.4,92.5 90 top
C86  100.7,80.9 180 top
C87  143.8,88.6 90 top
C88  110,84.5 0 top
C89  120.6,92 90 top
C90  101.2,83.1 180 top
C91  110,86.7 0 top
C92  122.8,92 90 top
C93  101.2,85.3 180 top
C94  124.99,92.02 90 top
C95  101.2,87.5 180 top
C96  123.8,87.4 180 top
D1  158.3,99.6 270 top
D2  155,99.6 90 top
D3  156.7,178 90 top
D4  174,178 90 top
D5  152.2,192.6 180 top
D6  182,197 0 top
D7  175,149 270 top
D8  175,132 270 top
D9  154,145 180 top
D10  154,130 180 top
D11  163,38.8 90 top
D12  156,27.9 270 top
D13  176,45 0 top
D14  175,23 0 top
D15  176,55 180 top
D16  175,13 180 top
D17  163.3,60.5 90 top
D18  156,13 180 top
IC1  116,136.8 270 bottom
IC2  110.4,89.6 90 top
L1  41.8,181 90 top
L2  37.6,86.4 270 top
P1  83,88 270 top
P2  160,114 0 top
P3  37,135.3 0 top
R1  152.8,80.9 90 top
R2  159.9,83.6 180 top
R3  168.7,83.6 0 top
R4  175.4,86.3 270 top
R5  137.9,101 270 top
R6  175.4,94.8 90 top
R7  123.8,102.4 180 top
R8  168.3,97.5 0 top
R9  119.4,107.9 0 top
R10  141.9,108 0 top
R11  115.6,106.2 0 top
R12  138.4,106.7 0 top
R13  119,104.8 0 top
R14  141.8,105.3 0 top
R15  161.2,98.4 270 top
R16  115.6,103.6 0 top
R17  138.4,103.7 0 top
R18  134.2,115.1 270 top
R19  124.2,118.7 180 top
R20  121.3,123.9 0 top
R21  136.5,124.4 0 top
R22  117.8,122.6 0 top
R23  139.72,122.89 0 top
R24  121.3,121.3 0 top
R25  141.4,120.7 0 top
R26  117.6,120 0 top
R27  141.4,117.5 0 top
R28  114.9,120.1 90 top
R29  117.6,117.8 180 top
R30  138.7,117 90 top
R31  138.7,120.2 90 top
R32  60.8,88.2 90 top
R33  67.4,85.6 270 top
R34  52.2,90.8 270 top
R35  70.1,86.5 180 top
R36  52.2,94 270 top
R37  113.9,24.7 90 bottom
R38  96,27 180 bottom
R39  113.9,10.2 90 bottom
R40  58,27 180 bottom
R41  20,27 180 bottom
R42  20,46 0 bottom
R43  126.3,135.5 0 top
R44  111.22,135.93 180 bottom
R45  58,46 0 bottom
R46  115.4,133.9 180 bottom
R47  126.3,133.2 180 top
R48  118.6,133.9 0 bottom
R49  96,46 0 bottom
R50  134,46 0 bottom
R51  105.1,91.3 0 top
R52  123.8,81.5 180 top
R53  105.1,89.1 0 top
R54  110.8,93.1 270 top
R55  113,93.1 270 top
R56  127.3,81.5 180 top
R57  111.2,132.2 180 bottom
TP1  127.7,94.7 0 top
TP2  123.1,147.7 0 top
U1  150.8,98.9 0 top
U2  130.7,105.6 270 top
U3  130.3,122 270 top
U4  104.4,132.7 270 bottom
U5  130,142 180 top
U6  100.8,90.4 90 top
U7  132.2,88 180 top
VR1  132,165 180 top
VR2  DNF-TPS56339DDCR  [SOT23-6']  57.7,86.4 270 top
VR3  70,142 270 top
VR4  100,139 270 top
X1  8,190 270 top
X2  192,178 90 top
X3  77,192 180 top
X4  168,192 180 top
X5  117,192 180 top
X6  97,192 180 top
X7  192,146 90 top
X8  192,132.5 90 top
X9  192,160 90 top
X10  8,90 270 top
X11  8,120 270 top
X12  8,105 270 top
X13  8,136 270 top
X14  192,85 90 top
X15  192,50 90 top
X16  192,19 90 top
X17  192,110 90 top

### Tracks (layer width: path | path; a pad name or v marks a point on that pad's centre or on a via)
!V_OUT_FWD_SS
  Top 0.5: R21.2 146,124.4 151.1,119.3 158.8,119.3 160,118.1 160,114 P2.9
!V_OUT_RVS_SS
  Top 0.5: P2.10 158.73,117.97 158.1,118.6 150.5,118.6 146.21,122.89 R23.2
!VALVE_GRID_CUR_SS
  Bottom 0.5: U4.6 101.45,133.65 81.95,114.15 81.73,113.93 P1.1
!VALVE_OUT_FWD_SS
  Top 0.5: R20.1 112.3,123.9 105.8,117.4 105.8,103.1 98.3,95.6 83.02,95.6 P1.3
!VALVE_OUT_RVS_SS  (via drill 0.4)
  Top 0.5: v114.5,125.1 111.5,125.1 104.5,118.1 104.5,103.5 98.25,97.25 97.89,96.89 P1.4 | v115,122.6 R22.1
  Bottom 0.5: v114.5,125.1 115,124.6 v115,122.6
!VALVE_PLATE_CUR_SS  (via drill 0.4)
  Top 0.5: U6.6 99.45,89.4 v98.2,89.4
  Bottom 0.5: v98.2,89.4 96.2,89.4 93.79,91.81 93.79,98.41 92.77,99.43 P1.2
!VALVE_VOLT_SS
  Top 0.5: R9.1 118.45,108 112.9,108 100,95.1 99.25,94.35 P1.6
+4V
  pour Top (no thermals): 33.3,90.3 4.9,90.3 4.9,82.5 33.3,82.5
+5V  (via drill 0.4)
  Top 0.5: R7.2 v120,102.4 v119.1,102.4 | R19.2 v122.1,118.7 v121.2,118.7 | R52.2 v121.3,81.5 v120.5,81.5 | R43.2 128,135.5 v128.2,135.7 v128.2,134.9
  Top 1: VR3.+V C52.1 C51.1 C50.1 68.75,109.8 C49.1
  other vias: 115.3,111.1 116.2,111.1 117.1,111.1 115.3,110.2 116.2,110.2 117.1,110.2 115.2,127 116.1,127 117,127 115.2,126.1 116.1,126.1 117,126.1 115.7,91 116.6,91 114.8,91 114.8,91.9 115.7,91.9 116.6,91.9 104.9,85.1 105.8,85.1 104,85.1 104,86 104.9,86 105.8,86 104.9,83.3 105.8,83.3 104,83.3 104,84.2 104.9,84.2 105.8,84.2 120.1,146 119.2,146 118.3,146 117.4,146 116.5,146 115.6,146 114.7,146
  pour Bottom (rank 5): -1.6,147 129,147 129,70 -1.6,70
  pour Top (no thermals): 114.8,111.6 119.5,111.6 120.2,110.9 128.7,110.9 128.7,109.6 114.8,109.6
  pour Top: 114.7,127.3 119.9,127.3 119.9,127 128.5,127 128.5,125.8 114.7,125.8
  pour Top (no thermals): 114.3,92.3 119.8,92.3 119.8,91.7 128.9,91.7 128.9,90.6 114.3,90.6
  pour Top: 101.5,89.7 101.5,81.7 101.1,81.7 101.1,79.3 109.7,79.3 109.7,88.9 108.2,88.9 108.2,87.6 103.2,87.6 103.2,89.7
  pour Top: 114.1,144 123,144 123,144.6 126.6,144.6 126.6,145.5 123,145.5 123,146.5 114.1,146.5
+12V
  Top 1: VR4.+V 97.65,114.75 C56.1 C55.1 C54.1 97.65,103.2 C53.1 81.1,102.8 78.3,100 78.3,87.2 75.85,84.75 R33.2
  Top 2: X12.2 5.03,101.83 2.75,104.1 2.75,124.85 5.2,127.3 7.7,127.3 | 7.7,127.3 91.3,127.3 97.6,121 VR4.+V | 7.7,127.3 7.7,132.53 X13.2
  pour Top (no thermals): 56.1,85.6 56.1,83.6 62.4,83.6 62.4,82.9 72.5,82.9 72.5,85.3 62.2,85.3 62.2,84.7 57.3,84.7 57.3,85.6
  pour Top (no thermals): 36.8,135 4.9,135 4.9,126.3 36.8,126.3
AC/L
  Top 1: C22.1 58.96,191.46 59,191.5
  Top 2: 65.6,191.5 70.15,191.5 X3.3 70.65,195.75 72.3,197.4 90.7,197.4 | C24.1 64.9,190.8 65.6,191.5 | 90.7,197.4 108.7,197.4 110.65,195.45 X5.3 | VR1.AC/L 116.5,155.9 110,155.9 | 110,155.9 64.1,155.9 VR3.AC/L 47.25,161.25 42.2,166.3 42.2,184.4 L1.3 59,191.5 65.6,191.5 | VR4.AC/L 110.4,156.3 110,155.9 | X6.3 90.65,197.35 90.7,197.4
AC/N
  Top 1: C26.2 58.96,172.86 58.7,172.6
  Top 2: 103.3,172.6 VR1.AC/N 123.35,177.95 X5.1 | 103.3,172.6 89.6,172.6 | 89.6,172.6 83.2,172.6 | 83.2,172.6 71.4,172.6 | 71.4,172.6 64.8,172.6 | VR3.AC/N 71.5,172.5 71.4,172.6 | VR4.AC/N 89.6,172.6 | C24.2 64.9,172.7 64.8,172.6 | X3.1 83.35,172.75 83.2,172.6 | X6.1 103.35,172.65 103.3,172.6 | L1.2 51.4,172.6 58.7,172.6 64.8,172.6
EARTH
  Top 1: C22.2 C26.1
  pour Top: -1,201 130,201 130,155 -1,155
  pour Bottom: -1,201 130,201 130,155 -1,155
GND  (via drill 0.4)
  Bottom 0.5: U4.2 107.1,132.7 107.6,133.2 107.6,136.3 107.25,136.65 C78.2 | IC1.2 119,136.8 119.45,136.35 119.45,135.5 | 119.45,135.5 R48.1 | 119.45,135.5 v120.9,135.5 v121.8,135.5 v122.7,135.5
  other vias: 99.6,141.2 99.6,140.3 100.5,140.3 101.4,140.3 102.3,140.3 102.3,141.2 101.4,141.2 100.5,141.2
  pour Top (rank 5): -1,147 129,147 129,70 -1,70
  pour Bottom: 98.9,136.1 106.6,136.1 106.6,137.2 103.9,137.2 103.9,139.5 113.2,139.5 113.2,142 98.9,142
GRID_CURR_AMP
  Bottom 0.5: R44.1 110.35,135.91 R57.1 109.9,131.75 U4.3
GRID_CURR_FAULT
  Top 0.5: TP2.TP 125,147.7 125.4,147.3 U5.9
GRID_CURR_OUT  (via drill 0.4)
  Top 0.5: v123.3,142.4 123.53,142.63 U5.12
  Bottom 0.5: v123.3,142.4 121.7,140.8 118.5,140.8 117.31,139.61 IC1.1 116.25,137.75 116.1,137.6 116.1,137 115.9,136.8 113.8,136.8 112.93,135.93 R44.2
N$1
  pour Top: 154,197 167.5,197 167.5,180 154,180
N$2
  pour Top: 168.5,197 182,197 182,180 168.5,180
N$3
  Bottom 0.5: R57.2 113.75,133.9 R46.1 114.55,135.71 IC1.4
N$6
  Top 0.25: VR2.5 67.35,86.4 R33.1 69.2,86.45 R35.2
N$8
  Top 0.5: R51.2 108.34,91.3 IC2.4 109.09,92.99 110.05,93.95 R54.1
N$9
  pour Top: 155,150 185,150 185,140 196,140 196,134 178,134 178,138 155,138
N$10
  pour Top (no thermals): 155,133.1 155,117 196,117 196,133.1
N$31
  Top 1: X1.1 14.45,196.35 C21.1 20,194.2 C23.1 33.3,190.5 L1.4
N$35
  Top 1: X1.3 15.55,183.65 C25.2 20.7,184.7 | 20.7,184.7 C23.2 | 20.7,184.7 29.7,184.7 34.3,180.1 L1.1
N$36
  Bottom 2: R49.1 101,46 C81.-VE C82.+VE 129,46 R50.2
N$40
  Top 0.5: R28.2 115.25,121.3 R24.1
N$41
  Top 0.5: U2.5 127.46,104.8 R13.2
N$42
  Top 0.5: R16.2 127.53,103.6 U2.6
N$44
  Top 0.5: R11.2 127.59,106.2 U2.4
N$46
  Top 0.5: U2.3 127.23,107.9 R9.2
N$47
  Top 0.5: R7.1 124.67,102.42 U2.7
N$50
  Top 0.5: U2.10 137.32,102.42 R5.1
N$51
  Top 0.5: U2.12 136.37,104.97 136.7,105.3 R14.1
N$54
  Top 0.5: R17.1 U2.11
N$55
  Top 0.5: R27.1 140.2,117.85 R30.2 137.85,117.85 135.6,120.09 U3.11
N$56
  Top 2: D11.3 163,45 D13.1
N$57
  Top 0.5: U2.13 137.09,106.23 R12.1
N$58
  Top 0.5: U2.14 136.1,107.5 136.6,108 R10.1
N$59
  Top 2: D17.1 170.55,55.05 D15.3
N$60  (via drill 0.4)
  Top 0.5: v147.1,108 R10.2 | U1.6 149.85,101.05 148.8,102.1 v147.9,102.1
  Bottom 0.5: v147.1,108 147.1,102.9 v147.9,102.1
N$61
  Top 0.5: U3.13 138.62,122.64 R23.1
N$62
  Top 0.5: U3.14 135.16,123.91 R21.1
N$63
  Top 0.5: U1.3 D2.C D1.A 161.15,97.6 R15.2 | 165.55,97.55 R8.1
  Top 1: R15.2 165.55,97.55
N$65
  Top 2: D12.3 169,22.45 D14.1
N$66
  Top 2: D18.1 D16.3
N$68
  Top 1: R6.1 R4.1
N$69
  Bottom 2: R45.1 63,46 C79.-VE C81.+VE 91,46 R49.2
N$70
  Top 1: R8.2 R6.2
N$71
  Bottom 2: C66.-VE 15,27 | 15,27 R41.1 | 15,27 15,46 | 15,46 C74.+VE | R42.2 15,46
N$72
  Bottom 2: R40.1 53,27 C64.-VE C66.+VE 25,27 R41.2
N$73
  Bottom 2: R38.1 91,27 C60.-VE C64.+VE 63,27 R40.2
N$74
  Bottom 2: R42.1 25,46 C74.-VE C79.+VE 53,46 R45.2
N$75
  Top 1: R4.2 R3.2
N$76
  Top 0.5: R52.1 R56.2 126.45,83.15 126.86,83.56 U7.16
N$77
  Top 1: R2.2 R1.2
N$78
  Top 1: R3.1 R2.1
N$79
  Top 0.5: C96.1 127.61,87.4 U7.13
N$92
  Top 0.5: R24.2 127.16,121.3 U3.5
N$93
  Top 0.5: U3.6 118.55,120.09 R26.2
N$94
  Top 0.5: U3.4 118.69,122.64 R22.2
N$95
  Top 0.5: R20.2 U3.3
N$96
  Top 0.5: R19.1 125.05,118.83 U3.7
N$97
  Top 0.5: R18.1 135.05,115.95 135.5,116.4 135.5,118.4 135.07,118.83 U3.10
N$98
  Top 0.5: U3.12 138.38,121.36 R31.2 140.2,121.05 R25.1
N$99
  pour Bottom: 112,24 141.5,24 141.5,12.1 112,12.1
N$104
  Top 0.25: R32.2 C39.1
N$105  (via drill 0.4)
  Top 0.25: C39.2 60.8,93.2 v60.6,93.4
  Bottom 0.25: v53.8,89.9 53.7,90 53.7,93.1 54,93.4 v60.6,93.4
  pour Top (no thermals): 41.8,90.4 41.8,81.7 55.6,81.7 55.6,85.7 55.9,86 57.1,86 57.1,86.8 56,86.8 55.8,87 55.8,88.6 54.5,88.6 54.5,90.4
N$106
  Top 0.5: R29.2 R26.1
N$148  (via drill 0.4)
  Top 0.25: R34.1 R36.2 53.95,93.15 v54.7,92.4 | v60,85.5 59.95,85.45 VR2.4
  Bottom 0.25: v54.7,92.4 60,87.1 v60,85.5
N$149
  Top 0.5: R47.2 R43.1 125.45,137.5 U5.16
N$154
  Top 0.5: IC2.3 112.55,90.55 113,91 R55.2 R54.2
N$155
  Top 0.5: C80.1 124.02,141.37 U5.13
N$156
  Bottom 0.5: R46.2 R48.2 117.31,134.34 IC1.3
N$300
  Top 0.25: VR2.6 R32.1
PLATE_CURR_AMP
  Top 0.5: R53.1 R51.1 102.15,91.3 U6.3
PLATE_CURR_FAULT
  Top 0.5: TP1.TP 127.7,92.44 U7.9
PLATE_CURR_OUT
  Top 0.5: U7.12 127.64,88.65 IC2.1 110.95,88.65 110,89.6 106.45,89.6 R53.2
V_MISO  (via drill 0.4)
  Top 0.5: R17.2 148.7,103.7 v149.85,102.55 150.8,101.6 U1.5
  Bottom 0.5: P2.11 161.27,110.37 160.6,109.7 154.8,109.7 149.85,104.75 v149.85,102.55
V_MOSI  (via drill 0.4)
  Top 0.5: R14.2 v148.4,105.3
  Bottom 0.5: v148.4,105.3 148.8,104.9 148.8,102 149.7,101.1 150.8,101.1 158.3,108.6 162.2,108.6 163.81,110.21 P2.13
V_SCLK
  Top 0.5: R12.2 148.7,106.7 | U1.4 151.75,103.65 148.7,106.7 | 148.7,106.7 148.7,108.4 150.3,110 161.3,110 162.5,111.2 162.5,114.04 P2.12
VALVE_2.5KV
  Top 2: D12.1 152.5,33.35 152.5,75.6 | 152.5,75.6 192,75.6 X14.1 X14.2 | R1.1 152.5,77.9 152.5,75.6
  Bottom 2: C60.+VE 101,27 | 101,27 R38.2 | 101,27 101,27.5 R37.2 120,27.5 C57.1 C58.1 C59.1 140,33.35 D12.1 D11.1
VALVE_5V  (via drill 0.4)
  Top 0.5: U1.1 149.85,98.75 150.1,99 153.2,99 153.8,99.6 158.1,99.6 158.3,99.8 D1.C | R5.2 v137.9,98.7 v137.9,97.8 | R18.2 v134.2,113 v134.2,112.1
  other vias: 144.6,110.7 144.6,109.8 146.4,110.7 146.4,109.8 145.5,110.7 145.5,109.8 141.5,96.6 144.1,96.6 143.3,96.6 145.9,96.6 142.4,96.6 145,96.6 146.8,96.6 148.6,96.6 147.7,96.6 135.2,126.2 136.1,126.2 137,126.2 137.9,126.2 138.8,126.2 139.8,126.2 140.7,126.2
  pour Top: 145,167 145,160 201,160 201,167
  pour Bottom (rank 5): 140,201.6 201.6,201.6 201.6,100 180,100 180,88.5 133,88.5 133,147 140,147
  pour Top: 132.7,109.4 132.7,111.1 146.7,111.1 146.7,109.4
  pour Top: 140.9,98.6 142.8,98.6 142.8,98.2 150.1,98.2 150.1,96 140.9,96
  pour Top: 132.4,125.8 143.1,125.8 143.1,127.7 132.4,127.7
VALVE_6V3
  pour Top: 156,170 186,170 186,179.1 195.2,179.1 195.2,185 183,185 183,179 156,179
VALVE_-30V  (via drill 0.4)
  other vias: 141.1,142.9 142,142.9 141.1,146.5 142,146.5 141.1,145.6 142,145.6 141.1,144.7 142,144.7 141.1,143.8 142,143.8
  pour Top (no thermals): 133.5,142.5 142.5,142.5 142.5,147 133.5,147
  pour Bottom: 140.6,147 140.6,140.8 201.6,140.8 201.6,147
VALVE_-30V_GEN
  pour Top: 133.5,141.5 144,141.5 144,149.8 152.5,149.8 152.5,120 151.3,120 146.2,125.1 146.2,137.2 133.5,137.2
VALVE_GND
  pour Top (rank 5): 140,201 201,201 201,100 180,100 180,88.5 133,88.5 133,147 140,147
VALVE_LOW
  Bottom 2: R50.1 139,46 C82.-VE 139,65.95 D17.3
  pour Top (rank 5): -1,64 135,64 135,87.5 201,87.5 201,-1 -1,-1
  pour Bottom (rank 5): -1.6,64 135,64 135,87.5 201.6,87.5 201.6,-1.6 -1.6,-1.6
VALVE_MISO  (via drill 0.4)
  Top 0.5: R16.1 112.6,103.6 100.8,91.8 100.8,91.1 100.1,90.4 U6.5 v97.7,90.4 97.1,89.8 97.1,87 95.6,85.5 79.9,85.5 79.8,85.6 79.8,93.6 80.55,94.35 P1.5
  Bottom 0.5: U4.5 101.7,132.7 99.8,130.8 99.8,92.5 v97.7,90.4
VALVE_MOSI  (via drill 0.4)
  Top 0.5: R13.1 v113.3,104.8
  Bottom 0.5: v113.3,104.8 102,93.5 102,91.5 98.9,88.4 94.6,88.4 92.5,90.5 83.04,90.5 P1.7
VALVE_PWR_+VE
  pour Top: 178,60 201,60 201,40 178,40
VALVE_PWR_-VE
  pour Top: 178,28 201,28 201,8 178,8
VALVE_SCLK  (via drill 0.4)
  Top 0.5: R11.1 113.1,106.2 v100.6,93.7 99.5,92.6 U6.4 93.45,91.35 92.99,91.81 P1.8
  Bottom 0.5: U4.4 101.85,131.75 100.6,130.5 v100.6,93.7

### Text on the board
Top: RF-PWR-001
tNames: 6V3 Out / Valve / Board | From 6V3 Transformer | To HV / Transformer | To 6V3 / Transformer | To -30V / Transformer | Spare 5V / VGND Out | RF-PWR-001 | 12V GND For Output Board | 5V Rasp Pi | GND | -30V For / Valve Board | 12V Arduino | GND | 5V GND For Input Board | From / 30V Transformer | Output Board SPI / and power | 12V GND For Input Board | HV GND Out | 2.5KV Out | HV | 4V GND SWR | Arduino SPI Input | HV | HV | HV | HV | 1.78KV Phase 1 | HV | HV | 1.78KV Phase 2 | HV | HV